# Altium project UZ_D_Voltage.PrjPCB (part 1 of 3)
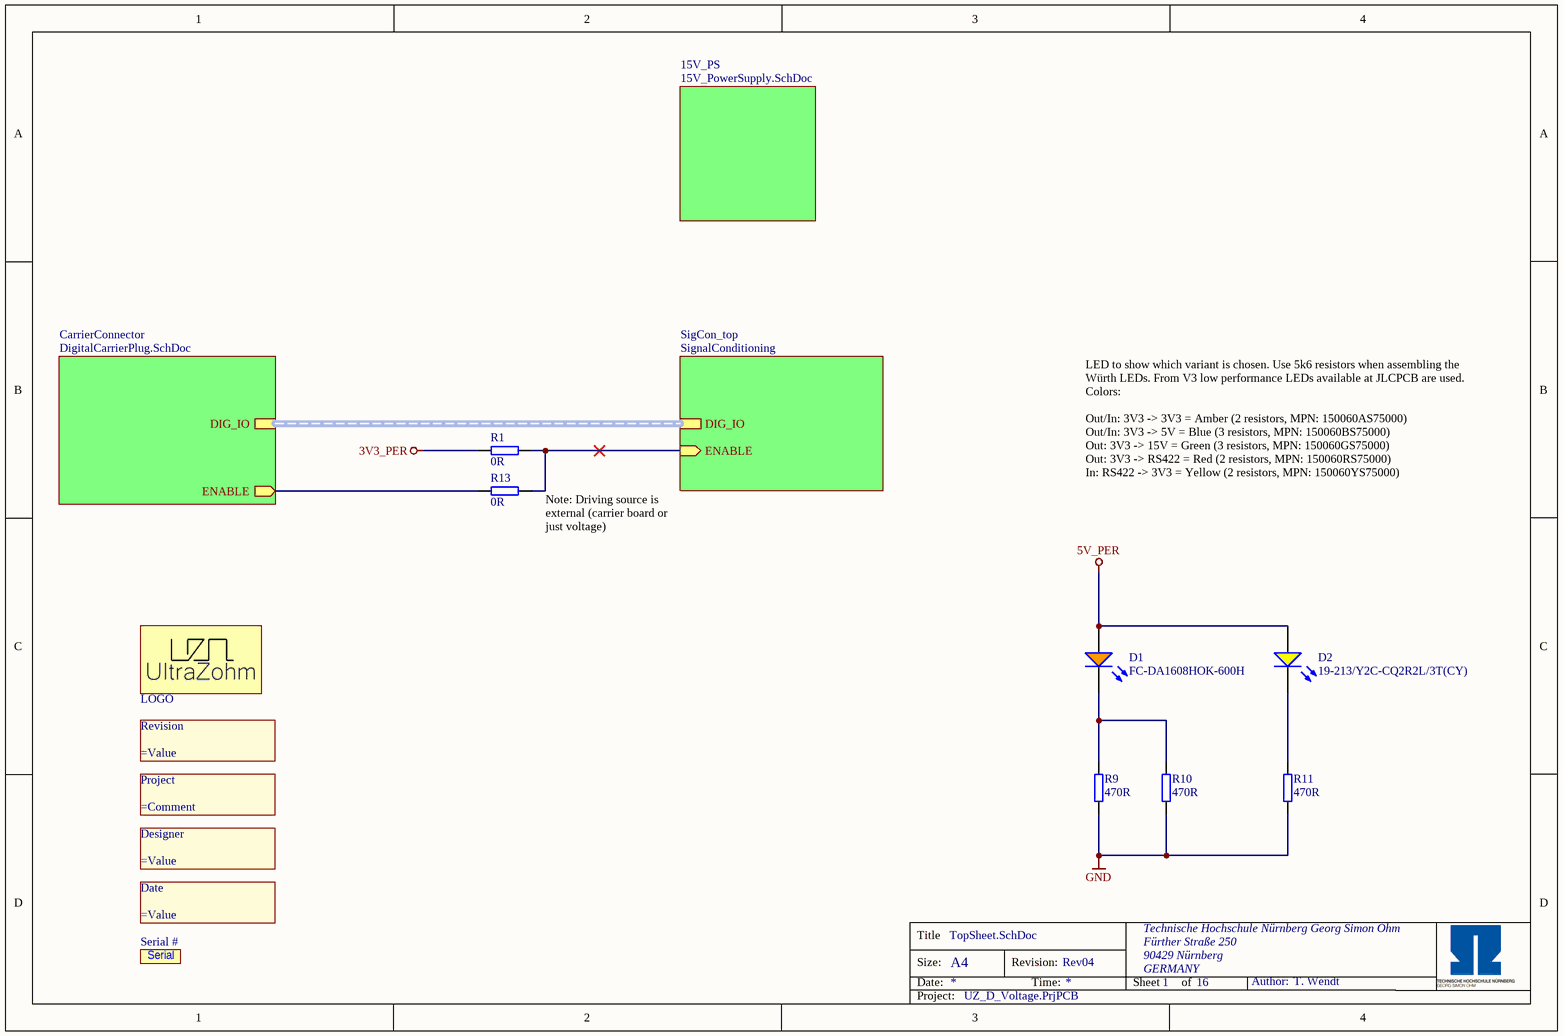
[diagram p0: TopSheet.SchDoc]
Author: T. Wendt; AuthorParam: T. Wendt; Date: 11/2019; FinDate: 08/2021; ProjectNameCustom: UZ_D_Voltage; ProjectRevision: Rev04
17 sheets, 308 parts. Net scope: hierarchical (ports join the sheet entries above them; power ports are global).
Board file: UZ_D_Voltage.PcbDoc
Sheets:
  TopSheet.SchDoc
    SigCon_top = SignalConditioning.SchDoc
      LS5V_top = 3V3_to_5V.SchDoc
        LS5V_B = TI_SN74LVCH16T245.SchDoc
        LS5V_A = TI_SN74LVCH16T245.SchDoc
        JPLS5V = Jumper5VLS.SchDoc
        DMP5VLS = Snubber5VLS.SchDoc
      LS15V_top = 5V_to_15V.SchDoc
        LS15V1 = ONSEMI_MC14504BDR2G.SchDoc
        LS15V2 = ONSEMI_MC14504BDR2G.SchDoc
        LS15V3 = ONSEMI_MC14504BDR2G.SchDoc
        LS15V4 = ONSEMI_MC14504BDR2G.SchDoc
        LS15V5 = ONSEMI_MC14504BDR2G.SchDoc
      RS422_top = SingleToDifferential.SchDoc
        RS422A = TI_DS26C31T.SchDoc
        RS4221 = TI_DS26C31T.SchDoc
        RS4222 = TI_DS26C31T.SchDoc
        RS4223 = TI_DS26C31T.SchDoc
        RS4224 = TI_DS26C31T.SchDoc
        RS4225 = TI_DS26C31T.SchDoc
        RS4226 = TI_DS26C31T.SchDoc
        RS4227 = TI_DS26C31T.SchDoc
      RS422_rec_top = DifferentialToSingle.SchDoc
        RS422_rec_H = TI_DS26C32AT.SchDoc
        RS422_rec1 = TI_DS26C32AT.SchDoc
        RS422_rec2 = TI_DS26C32AT.SchDoc
        RS422_rec3 = TI_DS26C32AT.SchDoc
        RS422_rec4 = TI_DS26C32AT.SchDoc
        RS422_rec5 = TI_DS26C32AT.SchDoc
        RS422_rec6 = TI_DS26C32AT.SchDoc
        RS422_rec7 = TI_DS26C32AT.SchDoc
      Bundle = SignalBundling.SchDoc
        NT15Diff = NetTieSingleAndDiff.SchDoc
        Termination = TermSingleAndDiff.SchDoc
    CarrierConnector = DigitalCarrierPlug.SchDoc
    15V_PS = 15V_PowerSupply.SchDoc

## Sheet TopSheet.SchDoc
size A4; Author: T. Wendt; CompanyName: Technische Hochschule Nürnberg Georg Simon Ohm; Address1: Fürther Straße 250; Address2: 90429 Nürnberg; Address3: GERMANY; DocumentNumber: 1; SheetNumber: 1; SheetTotal: 16; CompanyName2: Institut ELSYS

### Parts
D1  FC-DA1608HOK-600H  [WL-SMCW_0603]
D2  19-213/Y2C-CQ2R2L/3T(CY)  [WL-SMCW_0603]
Date  (no value)  [COMMENT]  (no BOM)
Designer  (no value)  [Designator:comment]  (no BOM)
LOGO  UZ Logo  [UZ_Logo_small]  (value not drawn)  (no BOM)
Project  (no value)  [COMMENT]  (no BOM)
R1  0R  [RES 0603_1608]
R9  470R  [RES 0603_1608]
R10  470R  [RES 0603_1608]
R11  470R  [RES 0603_1608]
R13  0R  [RES 0603_1608]
Revision  (no value)  [Designator:comment]  (no BOM)
Serial  Serial #  [SERIAL]  (no BOM)

### Sub-sheets
15V_PS = 15V_PowerSupply.SchDoc: no entries
CarrierConnector = DigitalCarrierPlug.SchDoc: ENABLE (out), DIG_IO (harness DigCon_DIG_IO)
SigCon_top = SignalConditioning: DIG_IO (harness DigCon_DIG_IO), ENABLE (in)

### Nets
3V3_PER: R1.1
5V_PER: D1.2(A) D2.2(A)
GND: R9.1 R10.1 R11.1
ENABLE: R1.2 R13.2 ; sheet SigCon_top/ENABLE
PS_DIG_GPIO_01: R13.1 ; sheet CarrierConnector/ENABLE
NetD1_1: D1.1(K) R9.2 R10.2
NetD2_1: D2.1(K) R11.2

### Buses and harness runs
harness sheet CarrierConnector/DIG_IO = sheet SigCon_top/DIG_IO

### Notes on the sheet
- LED to show which variant is chosen. Use 5k6 resistors when assembling the Würth LEDs. From V3 low performance LEDs available at JLCPCB are used.
  Colors:
  Out/In: 3V3 -> 3V3 = Amber (2 resistors, MPN: 150060AS75000)
  Out/In: 3V3 -> 5V = Blue (3 resistors, MPN: 150060BS75000)
  Out: 3V3 -> 15V = Green (3 resistors, MPN: 150060GS75000)
  Out: 3V3 -> RS422 = Red (2 resistors, MPN: 150060RS75000)
  In: RS422 -> 3V3 = Yellow (2 resistors, MPN: 150060YS75000)
- (near R13) Note: Driving source is external (carrier board or just voltage)
- Title
- Size:
- Date:
- A4
- Revision:
- Time:
- Sheet
- of
- Author:
- Project:

### Library data of the parts
D1 = FC-DA1608HOK-600H: LED ORANGE 600~610NM 80~220MCD@20MA TOP VIEW 0603 ROHS; Manufacturer: Foshan NationStar Optoelectronics; Type: Standard; Created from: T. Wendt; Color: amber; Forward Current I_f: 20 mA; Forward Voltage U_f: 2 V; Wavelength: 604 nm; Light Intensity: 150 mcd; Nominal Power: 40 mW; Manufacturer Part Number: FC-DA1608HOK-600H; PartID: 10; Created On: 03.03.2021 09:59:51; ComponentLink1Description: Datasheet; ComponentLink1URL: https://datasheet.lcsc.com/szlcsc/Foshan-NationStar-Optoelectronics-FC-DA1608HOK-600H_C84269.pdf; Component Type: LED Diode; Device Package: 0603; Last Updated: 04.03.2021 09:02:50; Mounting Type: SMD; Operating Temperature: -40 - 85 °C; Supplier 1: LCSC; Supplier Part Number 1: C84269; Live Cycle Status: 1; Stock number: not stored; LCSC Part Number: C84269
D2 = 19-213/Y2C-CQ2R2L/3T(CY): LED YELLOW 585.5~591.5NM 90~180MCD@20MA TOP VIEW 0603 ROHS; Manufacturer: Everlight Elec; Type: Standard; Created from: T. Wendt; Forward Current I_f: 20 mA; Forward Voltage U_f: 2 V; Wavelength: 590 nm; Light Intensity: 180 mcd; Nominal Power: 40 mW; Manufacturer Part Number: 19-213/Y2C-CQ2R2L/3T(CY); PartID: 9; Created On: 03.03.2021 10:06:23; ComponentLink1Description: Datasheet; ComponentLink1URL: https://datasheet.lcsc.com/szlcsc/Everlight-Elec-19-213-Y2C-CQ2R2L-3T-CY_C72038.pdf; Component Type: LED Diode; Device Package: 0603; Last Updated: 04.03.2021 09:02:49; Mounting Type: SMD; Operating Temperature: -40 - 85 °C; Supplier 1: LCSC; Supplier Part Number 1: C72038; Live Cycle Status: 1; Stock number: not stored; Color: yellow; LCSC Part Number: C72038
Date = 5: Create a project parameter named "FinDate" this is the value of this component. It is printed on the PCB. Once the parameter is updated (e.g. new revision) it gets updated on the PCB as well; Manufacturer: PCB Manufacturer; Manufacturer Part Number: Project End Date; Value: 08/2021; Created from: T. Wendt; PartID: 5; Created On: 01.03.2021 09:01:41; Component Type: Date of Project Finalization; Last Updated: 01.03.2021 09:01:41; Type: Standard (No BOM); Live Cycle Status: 1
Designer = 4: Create a project parameter named "Author" this is the value of this component. It is printed on the PCB. Once the parameter is updated (e.g. new revision) it gets updated on the PCB as well; Manufacturer: PCB Manufacturer; Manufacturer Part Number: Project Author; Value: T. Wendt; PartID: 4; Created On: 01.03.2021 08:53:41; Component Type: Project Author; Last Updated: 01.03.2021 09:20:27; Type: Standard (No BOM); Created from: T. Wendt; Live Cycle Status: 1
LOGO = UZ Logo: Official Project Logo of the UltraZohm; Created from: T. Wendt; PartID: 1; Created On: 19.02.2021 16:55:56; ComponentLink1Description: Homepage; ComponentLink1URL: https://ultrazohm.com; Component Type: Logo; Last Updated: 19.02.2021 17:22:43; Type: Graphical; Live Cycle Status: 1
Project = 2: Create a project parameter named "ProjectNameCustom" this is the value of this component and it is printed on the PCB.; Manufacturer: PCB Manufacturer; Value: UZ_D_Voltage; Created from: T. Wendt; PartID: 2; Created On: 01.03.2021 08:43:57; Component Type: Project Name; Last Updated: 01.03.2021 09:07:27; Manufacturer Part Number: Project Name; Type: Standard (No BOM); Live Cycle Status: 1
R1 R13 = RC0603JR-070RL: SMD resistor E24 series; Manufacturer: YAGEO; Tolerance: 5%; Created from: MGremer; Manufacturer Part Number: RC0603JR-070RL; PartID: 1; Created On: 14.12.2020 16:17:14; ComponentLink1Description: Datasheet; ComponentLink1URL: https://www.mouser.de/datasheet/2/447/PYu-RC_Group_51_RoHS_L_10-1664068.pdf; Component Type: SMD resistor; Device Package: 0603; Last Updated: 04.03.2021 09:09:42; Mounting Type: SMD; Supplier 1: Mouser; Supplier Part Number 1: 603-RC0603JR-070RL; Type: Resistor; Value: 0R; Live Cycle Status: 1; Stock number: Labor SMD Container; LCSC Part Number: C21189; Supplier 2: LCSC; Supplier Part Number 2: C21189
R9-R11 = RK73B1JTTD471J: SMD resistor E24 series; Manufacturer: KOA Speer; Tolerance: 5%; Created from: MGremer; Manufacturer Part Number: RK73B1JTTD471J; PartID: 66; Created On: 14.12.2020 16:17:14; ComponentLink1Description: Datasheet; ComponentLink1URL: https://www.mouser.de/datasheet/2/219/RK73B-1825463.pdf; Component Type: SMD resistor; Device Package: 0603; Last Updated: 04.03.2021 10:03:02; Mounting Type: SMD; Supplier 1: Mouser; Supplier Part Number 1: 660-RK73B1JTTD471J; Supplier 2: LCSC; Supplier Part Number 2: C23179; Type: Resistor; Value: 470R; Live Cycle Status: 1; Stock number: Labor SMD Container; LCSC Part Number: C23179
Revision = 3: Create a project parameter named "ProjectRevision" this is the value of this component. It is printed on the PCB. Once the parameter is updated (e.g. new revision) it gets updated on the PCB as well; Manufacturer: PCB Manufacturer; Value: Rev04; Created from: T. Wendt; PartID: 3; Created On: 01.03.2021 08:50:34; Component Type: Project Revision; Last Updated: 01.03.2021 09:28:36; Manufacturer Part Number: Project Revision; Type: Standard (No BOM); Live Cycle Status: 1
Serial = 6: Field to put in a serial number; Manufacturer: PCB Manufacturer; Created from: T. Wendt; PartID: 6; Created On: 02.03.2021 14:31:24; Component Type: Serial Number; Last Updated: 02.03.2021 14:31:24; Manufacturer Part Number: Serial Number; Type: Standard (No BOM); Live Cycle Status: 1

## Sheet SignalConditioning.SchDoc
size A4; Author: T. Wendt; CompanyName: Technische Hochschule Nürnberg Georg Simon Ohm; Address1: Fürther Straße 250; Address2: 90429 Nürnberg; Address3: GERMANY; DocumentNumber: 2; SheetNumber: 2; SheetTotal: 16; CompanyName2: Institut ELSYS
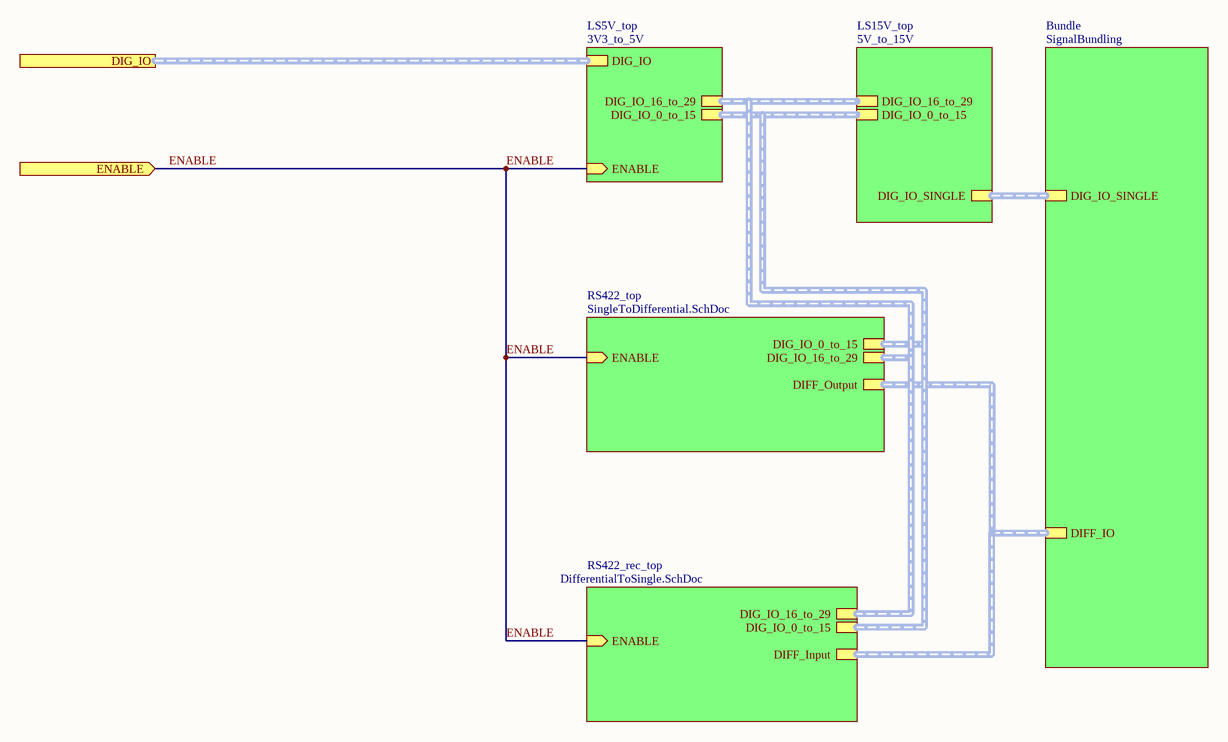
[diagram p1: SignalConditioning.SchDoc]

### Sub-sheets
Bundle = SignalBundling: DIFF_IO (harness DIFF_IO), DIG_IO_SINGLE (harness DIG_IO_SINGLE)
LS5V_top = 3V3_to_5V: DIG_IO (harness DigCon_DIG_IO), DIG_IO_16_to_29 (harness SN74LVCH16T245_B), DIG_IO_0_to_15 (harness SN74LVCH16T245_B), ENABLE (in)
LS15V_top = 5V_to_15V: DIG_IO_16_to_29 (harness SN74LVCH16T245_B), DIG_IO_0_to_15 (harness SN74LVCH16T245_B), DIG_IO_SINGLE (harness DIG_IO_SINGLE)
RS422_rec_top = DifferentialToSingle.SchDoc: ENABLE (in), DIFF_Input (harness DIFF_IO), DIG_IO_16_to_29 (harness SN74LVCH16T245_B), DIG_IO_0_to_15 (harness SN74LVCH16T245_B)
RS422_top = SingleToDifferential.SchDoc: ENABLE (in), DIG_IO_16_to_29 (harness SN74LVCH16T245_B), DIG_IO_0_to_15 (harness SN74LVCH16T245_B), DIFF_Output (harness DIFF_IO)

### Ports
DIG_IO (harness DigCon_DIG_IO), ENABLE (in)

### Nets
ENABLE: port ENABLE, sheet LS5V_top/ENABLE, sheet RS422_top/ENABLE, sheet RS422_rec_top/ENABLE

### Buses and harness runs
harness port DIG_IO = sheet LS5V_top/DIG_IO
harness sheet Bundle/DIFF_IO = sheet RS422_rec_top/DIFF_Input = sheet RS422_top/DIFF_Output
harness sheet Bundle/DIG_IO_SINGLE = sheet LS15V_top/DIG_IO_SINGLE
harness sheet LS5V_top/DIG_IO_0_to_15 = sheet LS15V_top/DIG_IO_0_to_15 = sheet RS422_rec_top/DIG_IO_0_to_15 = sheet RS422_top/DIG_IO_0_to_15
harness sheet LS5V_top/DIG_IO_16_to_29 = sheet LS15V_top/DIG_IO_16_to_29 = sheet RS422_rec_top/DIG_IO_16_to_29 = sheet RS422_top/DIG_IO_16_to_29

### Notes on the sheet
- Title
- Size:
- Date:
- A4
- Revision:
- Time:
- Sheet
- of
- Author:
- Project:

## Sheet 3V3_to_5V.SchDoc
size A4; Author: T. Wendt; CompanyName: Technische Hochschule Nürnberg Georg Simon Ohm; Address1: Fürther Straße 250; Address2: 90429 Nürnberg; Address3: GERMANY; DocumentNumber: 3; SheetNumber: 3; SheetTotal: 16; CompanyName2: Institut ELSYS
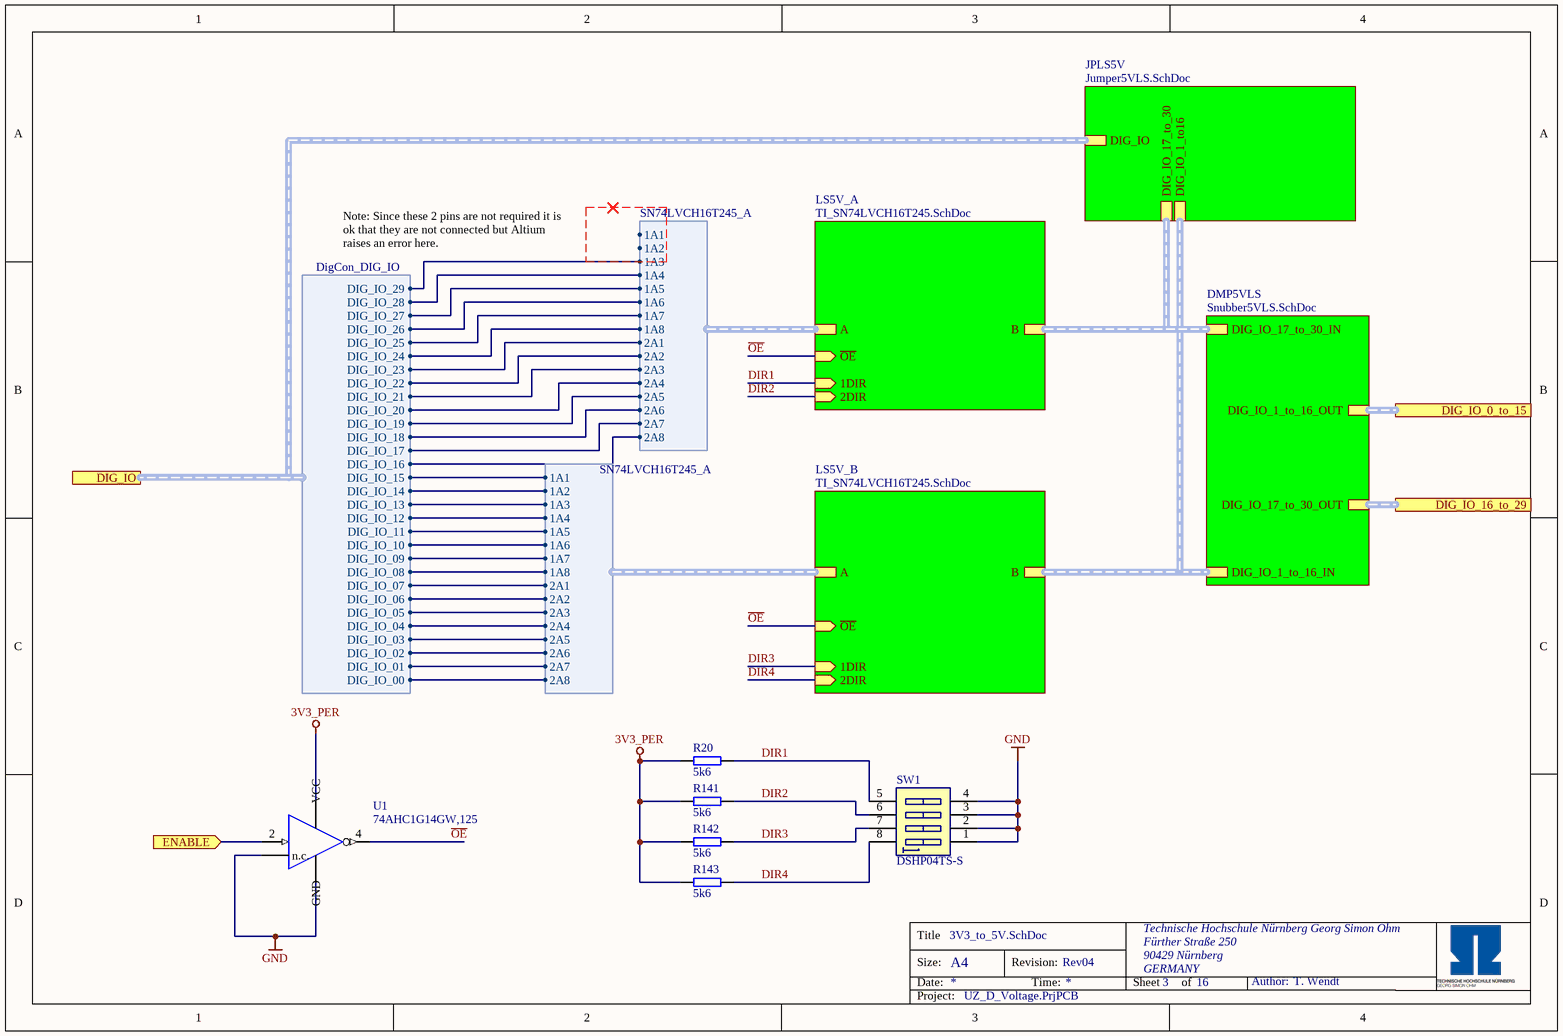
[diagram p2: 3V3_to_5V.SchDoc]

### Parts
R20  5k6  [RES 0603_1608]
R141  5k6  [RES 0603_1608]
R142  5k6  [RES 0603_1608]
R143  5k6  [RES 0603_1608]
SW1  DSHP04TS-S  [416131160804]
U1  74AHC1G14GW,125  [SOT353-1_N]

### Sub-sheets
DMP5VLS = Snubber5VLS.SchDoc: DIG_IO_1_to_16_IN (harness SN74LVCH16T245_B), DIG_IO_1_to_16_OUT (harness SN74LVCH16T245_B), DIG_IO_17_to_30_IN (harness SN74LVCH16T245_B), DIG_IO_17_to_30_OUT (harness SN74LVCH16T245_B)
JPLS5V = Jumper5VLS.SchDoc: DIG_IO (harness DigCon_DIG_IO), DIG_IO_17_to_30 (harness SN74LVCH16T245_B), DIG_IO_1_to16 (harness SN74LVCH16T245_B)
LS5V_A = TI_SN74LVCH16T245.SchDoc: A (harness SN74LVCH16T245_A), B (harness SN74LVCH16T245_B), 2DIR (in), ~{OE} (in), 1DIR (in)
LS5V_B = TI_SN74LVCH16T245.SchDoc: A (harness SN74LVCH16T245_A), B (harness SN74LVCH16T245_B), ~{OE} (in), 2DIR (in), 1DIR (in)

### Ports
DIG_IO (harness DigCon_DIG_IO), DIG_IO_0_to_15 (harness SN74LVCH16T245_B), DIG_IO_16_to_29 (harness SN74LVCH16T245_B), ENABLE (in)

### Harnesses
SN74LVCH16T245_A: 1A1, 1A2, 1A3, 1A4, 1A5, 1A6, 1A7, 1A8, 2A1, 2A2, 2A3, 2A4, 2A5, 2A6, 2A7, 2A8
DigCon_DIG_IO: DIG_IO_00, DIG_IO_01, DIG_IO_02, DIG_IO_03, DIG_IO_04, DIG_IO_05, DIG_IO_06, DIG_IO_07, DIG_IO_08, DIG_IO_09, DIG_IO_10, DIG_IO_11, DIG_IO_12, DIG_IO_13, DIG_IO_14, DIG_IO_15, DIG_IO_16, DIG_IO_17, DIG_IO_18, DIG_IO_19, DIG_IO_20, DIG_IO_21, DIG_IO_22, DIG_IO_23, DIG_IO_24, DIG_IO_25, DIG_IO_26, DIG_IO_27, DIG_IO_28, DIG_IO_29

### Nets
3V3_PER: R20.2 R141.2 R142.2 R143.2 U1.5(VCC)
GND: SW1.1 SW1.2 SW1.3 SW1.4 U1.1(n.c.) U1.3(GND)
DIG_IO_00: sheet LS5V_B/A.2A8, port DIG_IO.DIG_IO_00
DIG_IO_01: sheet LS5V_B/A.2A7, port DIG_IO.DIG_IO_01
DIG_IO_02: sheet LS5V_B/A.2A6, port DIG_IO.DIG_IO_02
DIG_IO_03: sheet LS5V_B/A.2A5, port DIG_IO.DIG_IO_03
DIG_IO_04: sheet LS5V_B/A.2A4, port DIG_IO.DIG_IO_04
DIG_IO_05: sheet LS5V_B/A.2A3, port DIG_IO.DIG_IO_05
DIG_IO_06: sheet LS5V_B/A.2A2, port DIG_IO.DIG_IO_06
DIG_IO_07: sheet LS5V_B/A.2A1, port DIG_IO.DIG_IO_07
DIG_IO_08: sheet LS5V_B/A.1A8, port DIG_IO.DIG_IO_08
DIG_IO_09: sheet LS5V_B/A.1A7, port DIG_IO.DIG_IO_09
DIG_IO_10: sheet LS5V_B/A.1A6, port DIG_IO.DIG_IO_10
DIG_IO_11: sheet LS5V_B/A.1A5, port DIG_IO.DIG_IO_11
DIG_IO_12: sheet LS5V_B/A.1A4, port DIG_IO.DIG_IO_12
DIG_IO_13: sheet LS5V_B/A.1A3, port DIG_IO.DIG_IO_13
DIG_IO_14: sheet LS5V_B/A.1A2, port DIG_IO.DIG_IO_14
DIG_IO_15: sheet LS5V_B/A.1A1, port DIG_IO.DIG_IO_15
DIG_IO_16: port DIG_IO.DIG_IO_16, sheet LS5V_A/A.2A8
DIG_IO_17: port DIG_IO.DIG_IO_17, sheet LS5V_A/A.2A7
DIG_IO_18: port DIG_IO.DIG_IO_18, sheet LS5V_A/A.2A6
DIG_IO_19: port DIG_IO.DIG_IO_19, sheet LS5V_A/A.2A5
DIG_IO_20: port DIG_IO.DIG_IO_20, sheet LS5V_A/A.2A4
DIG_IO_21: port DIG_IO.DIG_IO_21, sheet LS5V_A/A.2A3
DIG_IO_22: port DIG_IO.DIG_IO_22, sheet LS5V_A/A.2A2
DIG_IO_23: port DIG_IO.DIG_IO_23, sheet LS5V_A/A.2A1
DIG_IO_24: port DIG_IO.DIG_IO_24, sheet LS5V_A/A.1A8
DIG_IO_25: port DIG_IO.DIG_IO_25, sheet LS5V_A/A.1A7
DIG_IO_26: port DIG_IO.DIG_IO_26, sheet LS5V_A/A.1A6
DIG_IO_27: port DIG_IO.DIG_IO_27, sheet LS5V_A/A.1A5
DIG_IO_28: port DIG_IO.DIG_IO_28, sheet LS5V_A/A.1A4
DIG_IO_29: port DIG_IO.DIG_IO_29, sheet LS5V_A/A.1A3
DIR1: R20.1 SW1.5 ; sheet LS5V_A/1DIR
DIR2: R141.1 SW1.6 ; sheet LS5V_A/2DIR
DIR3: R142.1 SW1.7 ; sheet LS5V_B/1DIR
DIR4: R143.1 SW1.8 ; sheet LS5V_B/2DIR
ENABLE: U1.2(A) ; port ENABLE
~{OE}: U1.4(~{Y}) ; sheet LS5V_B/~{OE}, sheet LS5V_A/~{OE}

### Buses and harness runs
harness port DIG_IO = sheet JPLS5V/DIG_IO
harness port DIG_IO_0_to_15 = sheet DMP5VLS/DIG_IO_1_to_16_OUT
harness port DIG_IO_16_to_29 = sheet DMP5VLS/DIG_IO_17_to_30_OUT
harness sheet DMP5VLS/DIG_IO_1_to_16_IN = sheet JPLS5V/DIG_IO_1_to16 = sheet LS5V_B/B
harness sheet DMP5VLS/DIG_IO_17_to_30_IN = sheet JPLS5V/DIG_IO_17_to_30 = sheet LS5V_A/B

### Notes on the sheet
- Note: Since these 2 pins are not required it is ok that they are not connected but Altium raises an error here.
- Title
- Size:
- Date:
- A4
- Revision:
- Time:
- Sheet
- of
- Author:
- Project:

### Library data of the parts
R20 R141-R143 = RK73B1JTTDD562J: SMD resistor E24 series; Manufacturer: KOA Speer; Tolerance: 5%; Created from: MGremer; Manufacturer Part Number: RK73B1JTTDD562J; PartID: 92; Created On: 14.12.2020 16:17:14; ComponentLink1Description: Datasheet; ComponentLink1URL: https://www.mouser.de/datasheet/2/219/RK73B-1825463.pdf; Component Type: SMD resistor; Device Package: 0603; Last Updated: 04.03.2021 09:09:42; Mounting Type: SMD; Supplier 1: Mouser; Supplier Part Number 1: 660-RK73B1JTTDD562J; Type: Resistor; Value: 5k6; Live Cycle Status: 1; Stock number: Labor SMD Container; LCSC Part Number: C23189; Supplier 2: LCSC; Supplier Part Number 2: C23189
SW1 = DSHP04TS-S: 04p, 1.27mm Pitch, Horizontal, HP Type, SMT, flat Actuator, black, with Tape, T&R; Manufacturer: XKB Connectivity; Created from: T. Wendt; Manufacturer Part Number: DSHP04TS-S; PartID: 6; Created On: 02.03.2021 14:59:37; ComponentLink1Description: Datasheet; ComponentLink1URL: https://datasheet.lcsc.com/szlcsc/1912111437_XKB-Connectivity-DSHP04TS-S_C319050.pdf; Component Type: DIP-Switch; Device Package: DIP; Last Updated: 02.03.2021 14:59:37; Minimum Order: 1; Mounting Type: SMD; Supplier 1: LCSC; Supplier Part Number 1: C319050; Type: DIP-Switch; Live Cycle Status: 1; LCSC Part Number: C319050; Stock number: not stored
U1 = 74AHC1G14GW,125: Inverting Schmitt trigger; Manufacturer: Nexperia; Value: 5.5 V; Created from: MGremer; Manufacturer Part Number: 74AHC1G14GW,125; PartID: 1; Created On: 19.01.2021 10:03:39; ComponentLink1Description: Datasheet; ComponentLink1URL: https://www.mouser.de/datasheet/2/916/74AHC_AHCT1G14-1319577.pdf; Component Type: Inverting Schmitt trigger; Device Package: TSSOP-5; Last Updated: 04.03.2021 09:06:25; Mounting Type: SMD; Operating Temperature: -40 - 125 °C; Series: 74AHC; Supplier 1: Mouser; Supplier Part Number 1: 771-74AHC1G14GW-G; Supplier 2: LCSC; Supplier Part Number 2: C282410; Type: Schmitt trigger; Live Cycle Status: 1; Stock number: not stored; LCSC Part Number: C282410

## Sheet TI_SN74LVCH16T245.SchDoc
size A4; Author: T. Wendt; CompanyName: Technische Hochschule Nürnberg Georg Simon Ohm; Address1: Fürther Straße 250; Address2: 90429 Nürnberg; Address3: GERMANY; SheetNumber: 17; SheetTotal: 17; CompanyName2: Institut ELSYS
Used 2 times, as channels SigCon_top/LS5V_top/LS5V_B, SigCon_top/LS5V_top/LS5V_A. Parts and nets are listed once, with the designators drawn on the sheet.
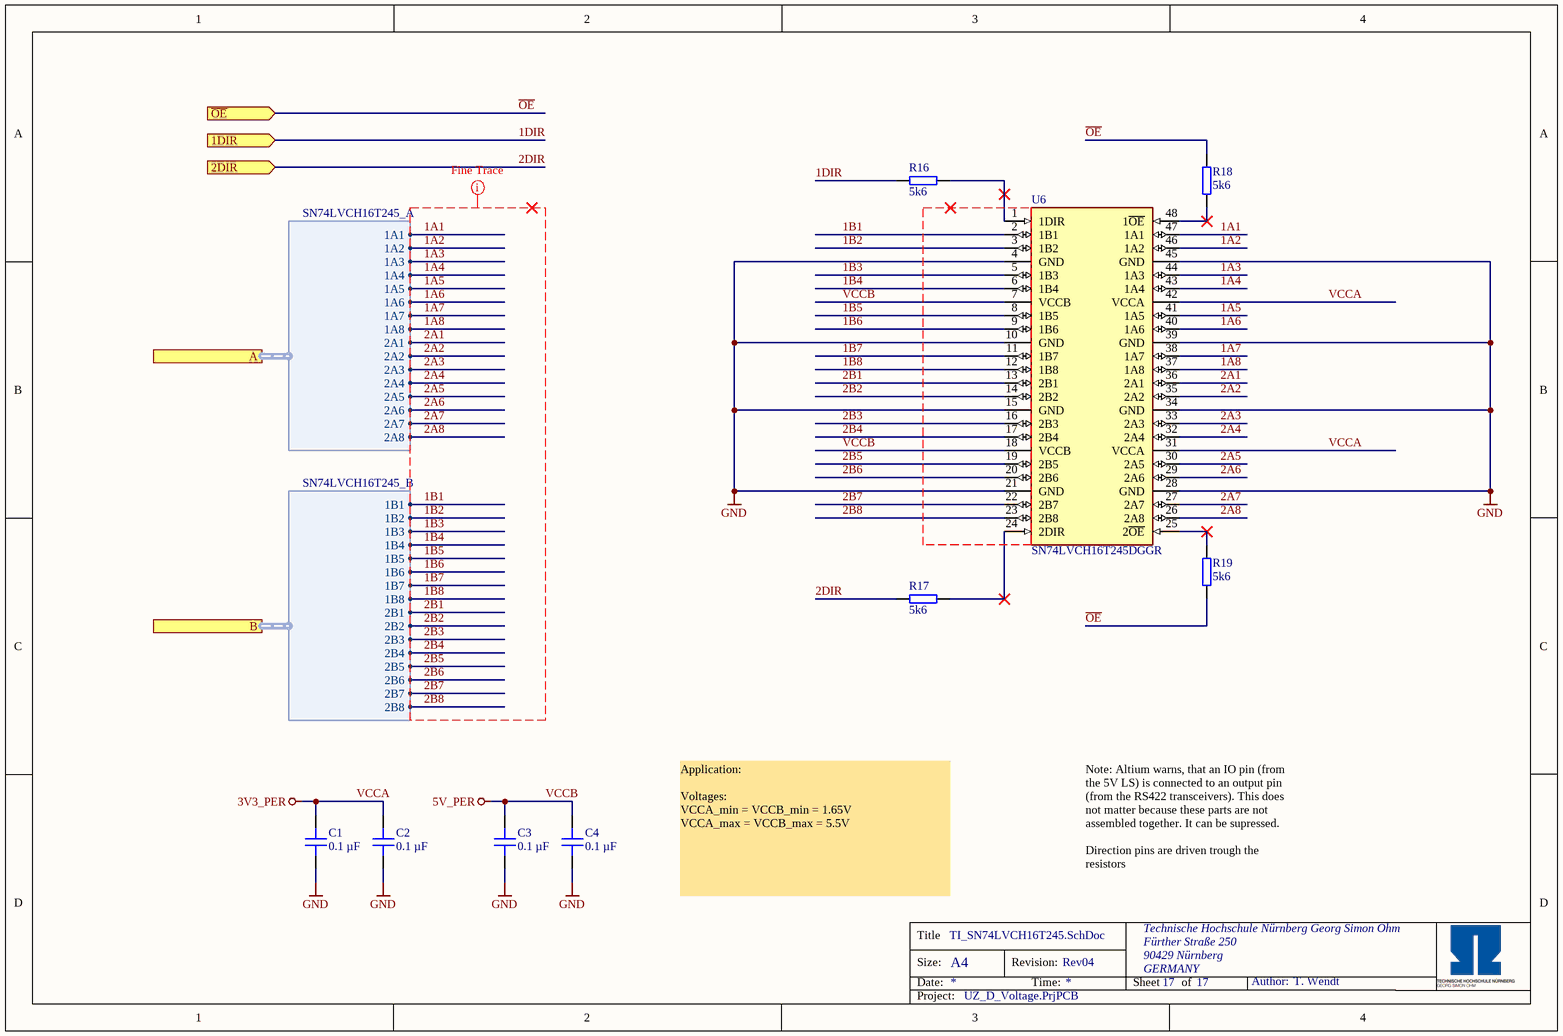
[diagram p3: TI_SN74LVCH16T245.SchDoc]

### Parts
C1  0.1 µF  [C_0603]
C2  0.1 µF  [C_0603]
C3  0.1 µF  [C_0603]
C4  0.1 µF  [C_0603]
R16  5k6  [RES 0603_1608]
R17  5k6  [RES 0603_1608]
R18  5k6  [RES 0603_1608]
R19  5k6  [RES 0603_1608]
U6  SN74LVCH16T245DGGR  [TI_DGG-R-PDSO-G48N]

### Ports
1DIR (in), 2DIR (in), A (harness SN74LVCH16T245_A), B (harness SN74LVCH16T245_B), ~{OE} (in)

### Harnesses
SN74LVCH16T245_A: 1A1, 1A2, 1A3, 1A4, 1A5, 1A6, 1A7, 1A8, 2A1, 2A2, 2A3, 2A4, 2A5, 2A6, 2A7, 2A8
SN74LVCH16T245_B: 1B1, 1B2, 1B3, 1B4, 1B5, 1B6, 1B7, 1B8, 2B1, 2B2, 2B3, 2B4, 2B5, 2B6, 2B7, 2B8

### Nets
GND: C1.1 C2.1 C3.1 C4.1 U6.4(GND) U6.10(GND) U6.15(GND) U6.21(GND) U6.28(GND) U6.34(GND) U6.39(GND) U6.45(GND)
VCCA: C1.2 C2.2 U6.31(VCCA) U6.42(VCCA)  [also labelled 3V3_PER]
VCCB: C3.2 C4.2 U6.7(VCCB) U6.18(VCCB)  [also labelled 5V_PER]
1A1: U6.47(1A1) ; port A.1A1
1A2: U6.46(1A2) ; port A.1A2
1A3: U6.44(1A3) ; port A.1A3
1A4: U6.43(1A4) ; port A.1A4
1A5: U6.41(1A5) ; port A.1A5
1A6: U6.40(1A6) ; port A.1A6
1A7: U6.38(1A7) ; port A.1A7
1A8: U6.37(1A8) ; port A.1A8
1B1: U6.2(1B1) ; port B.1B1
1B2: U6.3(1B2) ; port B.1B2
1B3: U6.5(1B3) ; port B.1B3
1B4: U6.6(1B4) ; port B.1B4
1B5: U6.8(1B5) ; port B.1B5
1B6: U6.9(1B6) ; port B.1B6
1B7: U6.11(1B7) ; port B.1B7
1B8: U6.12(1B8) ; port B.1B8
1DIR: R16.2 ; port 1DIR
2A1: U6.36(2A1) ; port A.2A1
2A2: U6.35(2A2) ; port A.2A2
2A3: U6.33(2A3) ; port A.2A3
2A4: U6.32(2A4) ; port A.2A4
2A5: U6.30(2A5) ; port A.2A5
2A6: U6.29(2A6) ; port A.2A6
2A7: U6.27(2A7) ; port A.2A7
2A8: U6.26(2A8) ; port A.2A8
2B1: U6.13(2B1) ; port B.2B1
2B2: U6.14(2B2) ; port B.2B2
2B3: U6.16(2B3) ; port B.2B3
2B4: U6.17(2B4) ; port B.2B4
2B5: U6.19(2B5) ; port B.2B5
2B6: U6.20(2B6) ; port B.2B6
2B7: U6.22(2B7) ; port B.2B7
2B8: U6.23(2B8) ; port B.2B8
2DIR: R17.1 ; port 2DIR
~{OE}: R18.2 R19.1 ; port ~{OE}
NetR16_1: R16.1 U6.1(1DIR)
NetR17_2: R17.2 U6.24(2DIR)
NetR18_1: R18.1 U6.48(1~{OE})
NetR19_2: R19.2 U6.25(2~{OE})

### Channels
SigCon_top/LS5V_top/LS5V_B: designators end in A; ports 1DIR=DIR3 2DIR=DIR4 ~{OE}=~{OE}
SigCon_top/LS5V_top/LS5V_A: designators end in B; ports 1DIR=DIR1 2DIR=DIR2 ~{OE}=~{OE}

### Layout directives
net class Fine Trace: 1A1, 1A2, 1A3, 1A4, 1A5, 1A6, 1A7, 1A8, 1B1, 1B2, 1B3, 1B4, 1B5, 1B6, 1B7, 1B8, 2A1, 2A2, 2A3, 2A4, 2A5, 2A6, 2A7, 2A8, 2B1, 2B2, 2B3, 2B4, 2B5, 2B6, 2B7, 2B8

### Notes on the sheet
- Application:
  Voltages:
  VCCA_min = VCCB_min = 1.65V
  VCCA_max = VCCB_max = 5.5V
- Note: Altium warns, that an IO pin (from the 5V LS) is connected to an output pin (from the RS422 transceivers). This does not matter because these parts are not assembled together. It can be supressed.
  Direction pins are driven trough the resistors
- Title
- Size:
- Date:
- A4
- Revision:
- Time:
- Sheet
- of
- Author:
- Project:

### Library data of the parts
C1-C4 = C0603X104K5RAC7411: Capacitor 0603, 50 VDC, 0.1 µF, X7R; Manufacturer: KEMET; Tolerance: 10 %; Voltage Rating: 50 VDC; Created from: MGremer; Manufacturer Part Number: C0603X104K5RAC7411; PartID: 3; Created On: 20.12.2020 13:54:13; ComponentLink1Description: Datasheet; ComponentLink1URL: https://www.mouser.de/datasheet/2/212/1/KEM_C1013_X7R_FT_CAP_SMD-1103280.pdf; Component Type: Capacitor 0603; Device Package: 0603; Last Updated: 04.03.2021 09:24:28; Mounting Type: SMD; Operating Temperature: -55 - 125°C; Series: SMD Comm X7R Flex; Supplier 1: Mouser; Supplier Part Number 1: 80-C0603X104K5R7411; Type: Capacitor; Value: 0.1 µF; Live Cycle Status: 1; Stock number: Labor SMD Container; LCSC Part Number: C14663; Supplier 2: LCSC; Supplier Part Number 2: C14663
R16-R19 = RK73B1JTTDD562J: as R20 on sheet 3V3_to_5V; Manufacturer Part Number: RK73B1JTTDD562J; PartID: 92; Created On: 14.12.2020 16:17:14; ComponentLink1Description: Datasheet; ComponentLink1URL: https://www.mouser.de/datasheet/2/219/RK73B-1825463.pdf; Component Type: SMD resistor; Device Package: 0603; Last Updated: 04.03.2021 09:09:42; Mounting Type: SMD; Supplier 1: Mouser; Supplier Part Number 1: 660-RK73B1JTTDD562J; Type: Resistor; Value: 5k6; Live Cycle Status: 1; Stock number: Labor SMD Container; LCSC Part Number: C23189; Supplier 2: LCSC; Supplier Part Number 2: C23189
U6 = SN74LVCH16T245DGGR: 16-Bit Dual supply Bus Transceiver with configurable Level Shifter and Tri State Output; Manufacturer: Texas Instruments; Value: 1.65 - 5.5 V; Created from: T. Wendt; Manufacturer Part Number: SN74LVCH16T245DGGR; PartID: 4; Created On: 01.03.2021 11:28:41; ComponentLink1Description: Datasheet; ComponentLink1URL: https://www.ti.com/lit/ds/symlink/sn74lvch16t245.pdf?HQS=dis-mous-null-mousermode-dsf-pf-null-wwe&ts=1610963085859&ref_url=https%253A%252F%252Fwww.mouser.it%252F; Component Type: Level Shifter; Device Package: TSSOP-48; Last Updated: 04.03.2021 09:07:38; Mounting Type: SMD; Operating Temperature: -40 - 85 °C; Supplier 1: Mouser; Supplier Part Number 1: 595-SN74LVCH16T245GR; Type: Standard; Live Cycle Status: 1; Stock number: not stored; LCSC Part Number: C352975; Supplier 2: LCSC; Supplier Part Number 2: C352975

## Sheet Jumper5VLS.SchDoc
size A4; Author: T. Wendt; CompanyName: Technische Hochschule Nürnberg Georg Simon Ohm; Address1: Fürther Straße 250; Address2: 90429 Nürnberg; Address3: GERMANY; DocumentNumber: 12; SheetNumber: 12; SheetTotal: 16; CompanyName2: Institut ELSYS
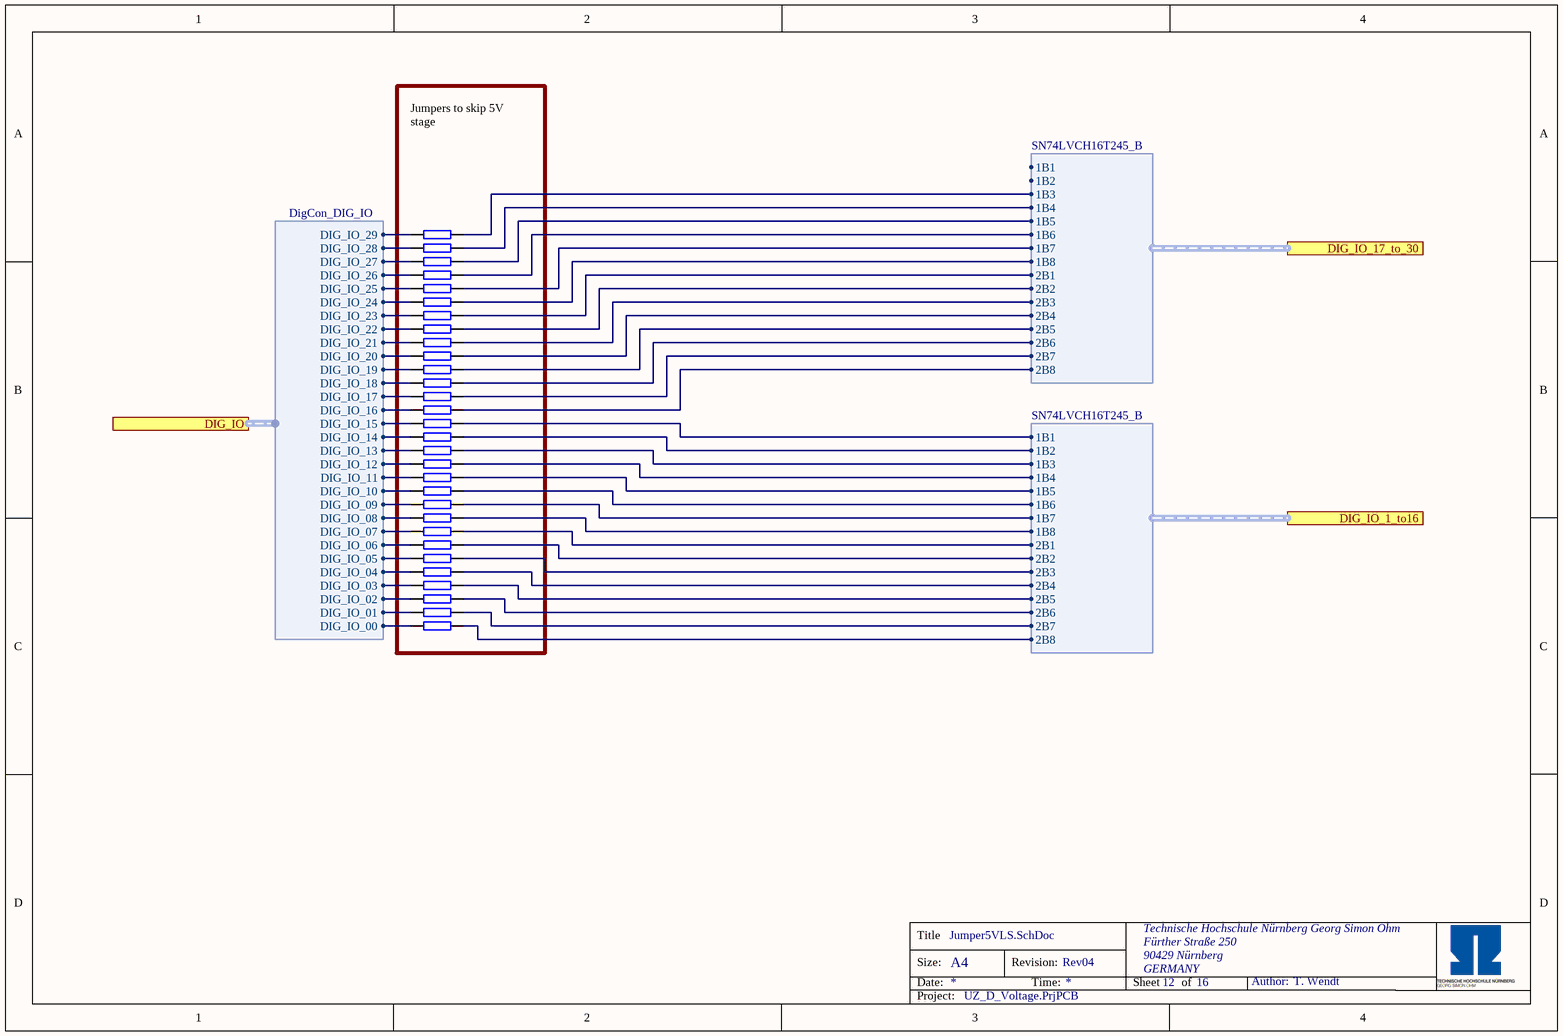
[diagram p4: Jumper5VLS.SchDoc]

### Parts
R51  0R  [RES 0603_1608]  (value not drawn)
R52  0R  [RES 0603_1608]  (value not drawn)
R53  0R  [RES 0603_1608]  (value not drawn)
R54  0R  [RES 0603_1608]  (value not drawn)
R55  0R  [RES 0603_1608]  (value not drawn)
R56  0R  [RES 0603_1608]  (value not drawn)
R57  0R  [RES 0603_1608]  (value not drawn)
R58  0R  [RES 0603_1608]  (value not drawn)
R59  0R  [RES 0603_1608]  (value not drawn)
R60  0R  [RES 0603_1608]  (value not drawn)
R61  0R  [RES 0603_1608]  (value not drawn)
R62  0R  [RES 0603_1608]  (value not drawn)
R63  0R  [RES 0603_1608]  (value not drawn)
R64  0R  [RES 0603_1608]  (value not drawn)
R65  0R  [RES 0603_1608]  (value not drawn)
R66  0R  [RES 0603_1608]  (value not drawn)
R67  0R  [RES 0603_1608]  (value not drawn)
R68  0R  [RES 0603_1608]  (value not drawn)
R69  0R  [RES 0603_1608]  (value not drawn)
R70  0R  [RES 0603_1608]  (value not drawn)
R71  0R  [RES 0603_1608]  (value not drawn)
R72  0R  [RES 0603_1608]  (value not drawn)
R73  0R  [RES 0603_1608]  (value not drawn)
R74  0R  [RES 0603_1608]  (value not drawn)
R75  0R  [RES 0603_1608]  (value not drawn)
R76  0R  [RES 0603_1608]  (value not drawn)
R77  0R  [RES 0603_1608]  (value not drawn)
R78  0R  [RES 0603_1608]  (value not drawn)
R79  0R  [RES 0603_1608]  (value not drawn)
R80  0R  [RES 0603_1608]  (value not drawn)

### Ports
DIG_IO (harness DigCon_DIG_IO), DIG_IO_1_to16 (harness SN74LVCH16T245_B), DIG_IO_17_to_30 (harness SN74LVCH16T245_B)

### Harnesses
SN74LVCH16T245_B: 1B1, 1B2, 1B3, 1B4, 1B5, 1B6, 1B7, 1B8, 2B1, 2B2, 2B3, 2B4, 2B5, 2B6, 2B7, 2B8
DigCon_DIG_IO: DIG_IO_00, DIG_IO_01, DIG_IO_02, DIG_IO_03, DIG_IO_04, DIG_IO_05, DIG_IO_06, DIG_IO_07, DIG_IO_08, DIG_IO_09, DIG_IO_10, DIG_IO_11, DIG_IO_12, DIG_IO_13, DIG_IO_14, DIG_IO_15, DIG_IO_16, DIG_IO_17, DIG_IO_18, DIG_IO_19, DIG_IO_20, DIG_IO_21, DIG_IO_22, DIG_IO_23, DIG_IO_24, DIG_IO_25, DIG_IO_26, DIG_IO_27, DIG_IO_28, DIG_IO_29

### Nets
1B1: R65.2 ; port DIG_IO_1_to16.1B1
1B2: R66.2 ; port DIG_IO_1_to16.1B2
1B3: R67.2 ; port DIG_IO_1_to16.1B3
1B3: R51.2 ; port DIG_IO_17_to_30.1B3  [a separate net that carries the same name]
1B4: R68.2 ; port DIG_IO_1_to16.1B4
1B4: R52.2 ; port DIG_IO_17_to_30.1B4  [a separate net that carries the same name]
1B5: R69.2 ; port DIG_IO_1_to16.1B5
1B5: R53.2 ; port DIG_IO_17_to_30.1B5  [a separate net that carries the same name]
1B6: R70.2 ; port DIG_IO_1_to16.1B6
1B6: R54.2 ; port DIG_IO_17_to_30.1B6  [a separate net that carries the same name]
1B7: R71.2 ; port DIG_IO_1_to16.1B7
1B7: R55.2 ; port DIG_IO_17_to_30.1B7  [a separate net that carries the same name]
1B8: R72.2 ; port DIG_IO_1_to16.1B8
1B8: R56.2 ; port DIG_IO_17_to_30.1B8  [a separate net that carries the same name]
2B1: R73.2 ; port DIG_IO_1_to16.2B1
2B1: R57.2 ; port DIG_IO_17_to_30.2B1  [a separate net that carries the same name]
2B2: R74.2 ; port DIG_IO_1_to16.2B2
2B2: R58.2 ; port DIG_IO_17_to_30.2B2  [a separate net that carries the same name]
2B3: R75.2 ; port DIG_IO_1_to16.2B3
2B3: R59.2 ; port DIG_IO_17_to_30.2B3  [a separate net that carries the same name]
2B4: R76.2 ; port DIG_IO_1_to16.2B4
2B4: R60.2 ; port DIG_IO_17_to_30.2B4  [a separate net that carries the same name]
2B5: R77.2 ; port DIG_IO_1_to16.2B5
2B5: R61.2 ; port DIG_IO_17_to_30.2B5  [a separate net that carries the same name]
2B6: R78.2 ; port DIG_IO_1_to16.2B6
2B6: R62.2 ; port DIG_IO_17_to_30.2B6  [a separate net that carries the same name]
2B7: R79.2 ; port DIG_IO_1_to16.2B7
2B7: R63.2 ; port DIG_IO_17_to_30.2B7  [a separate net that carries the same name]
2B8: R80.2 ; port DIG_IO_1_to16.2B8
2B8: R64.2 ; port DIG_IO_17_to_30.2B8  [a separate net that carries the same name]
DIG_IO_00: R80.1 ; port DIG_IO.DIG_IO_00
DIG_IO_01: R79.1 ; port DIG_IO.DIG_IO_01
DIG_IO_02: R78.1 ; port DIG_IO.DIG_IO_02
DIG_IO_03: R77.1 ; port DIG_IO.DIG_IO_03
DIG_IO_04: R76.1 ; port DIG_IO.DIG_IO_04
DIG_IO_05: R75.1 ; port DIG_IO.DIG_IO_05
DIG_IO_06: R74.1 ; port DIG_IO.DIG_IO_06
DIG_IO_07: R73.1 ; port DIG_IO.DIG_IO_07
DIG_IO_08: R72.1 ; port DIG_IO.DIG_IO_08
DIG_IO_09: R71.1 ; port DIG_IO.DIG_IO_09
DIG_IO_10: R70.1 ; port DIG_IO.DIG_IO_10
DIG_IO_11: R69.1 ; port DIG_IO.DIG_IO_11
DIG_IO_12: R68.1 ; port DIG_IO.DIG_IO_12
DIG_IO_13: R67.1 ; port DIG_IO.DIG_IO_13
DIG_IO_14: R66.1 ; port DIG_IO.DIG_IO_14
DIG_IO_15: R65.1 ; port DIG_IO.DIG_IO_15
DIG_IO_16: R64.1 ; port DIG_IO.DIG_IO_16
DIG_IO_17: R63.1 ; port DIG_IO.DIG_IO_17
DIG_IO_18: R62.1 ; port DIG_IO.DIG_IO_18
DIG_IO_19: R61.1 ; port DIG_IO.DIG_IO_19
DIG_IO_20: R60.1 ; port DIG_IO.DIG_IO_20
DIG_IO_21: R59.1 ; port DIG_IO.DIG_IO_21
DIG_IO_22: R58.1 ; port DIG_IO.DIG_IO_22
DIG_IO_23: R57.1 ; port DIG_IO.DIG_IO_23
DIG_IO_24: R56.1 ; port DIG_IO.DIG_IO_24
DIG_IO_25: R55.1 ; port DIG_IO.DIG_IO_25
DIG_IO_26: R54.1 ; port DIG_IO.DIG_IO_26
DIG_IO_27: R53.1 ; port DIG_IO.DIG_IO_27
DIG_IO_28: R52.1 ; port DIG_IO.DIG_IO_28
DIG_IO_29: R51.1 ; port DIG_IO.DIG_IO_29

### Notes on the sheet
- Jumpers to skip 5V stage
- Title
- Size:
- Date:
- A4
- Revision:
- Time:
- Sheet
- of
- Author:
- Project:

### Library data of the parts
R51-R80 = RC0603JR-070RL: as R1 on sheet TopSheet; Manufacturer Part Number: RC0603JR-070RL; PartID: 1; Created On: 14.12.2020 16:17:14; ComponentLink1Description: Datasheet; ComponentLink1URL: https://www.mouser.de/datasheet/2/447/PYu-RC_Group_51_RoHS_L_10-1664068.pdf; Component Type: SMD resistor; Device Package: 0603; Last Updated: 04.03.2021 09:09:42; Mounting Type: SMD; Supplier 1: Mouser; Supplier Part Number 1: 603-RC0603JR-070RL; Type: Resistor; Value: 0R; Live Cycle Status: 1; Stock number: Labor SMD Container; LCSC Part Number: C21189; Supplier 2: LCSC; Supplier Part Number 2: C21189

## Sheet Snubber5VLS.SchDoc
size A4; Author: T. Wendt; CompanyName: Technische Hochschule Nürnberg Georg Simon Ohm; Address1: Fürther Straße 250; Address2: 90429 Nürnberg; Address3: GERMANY; DocumentNumber: 12; SheetNumber: 12; SheetTotal: 16; CompanyName2: Institut ELSYS
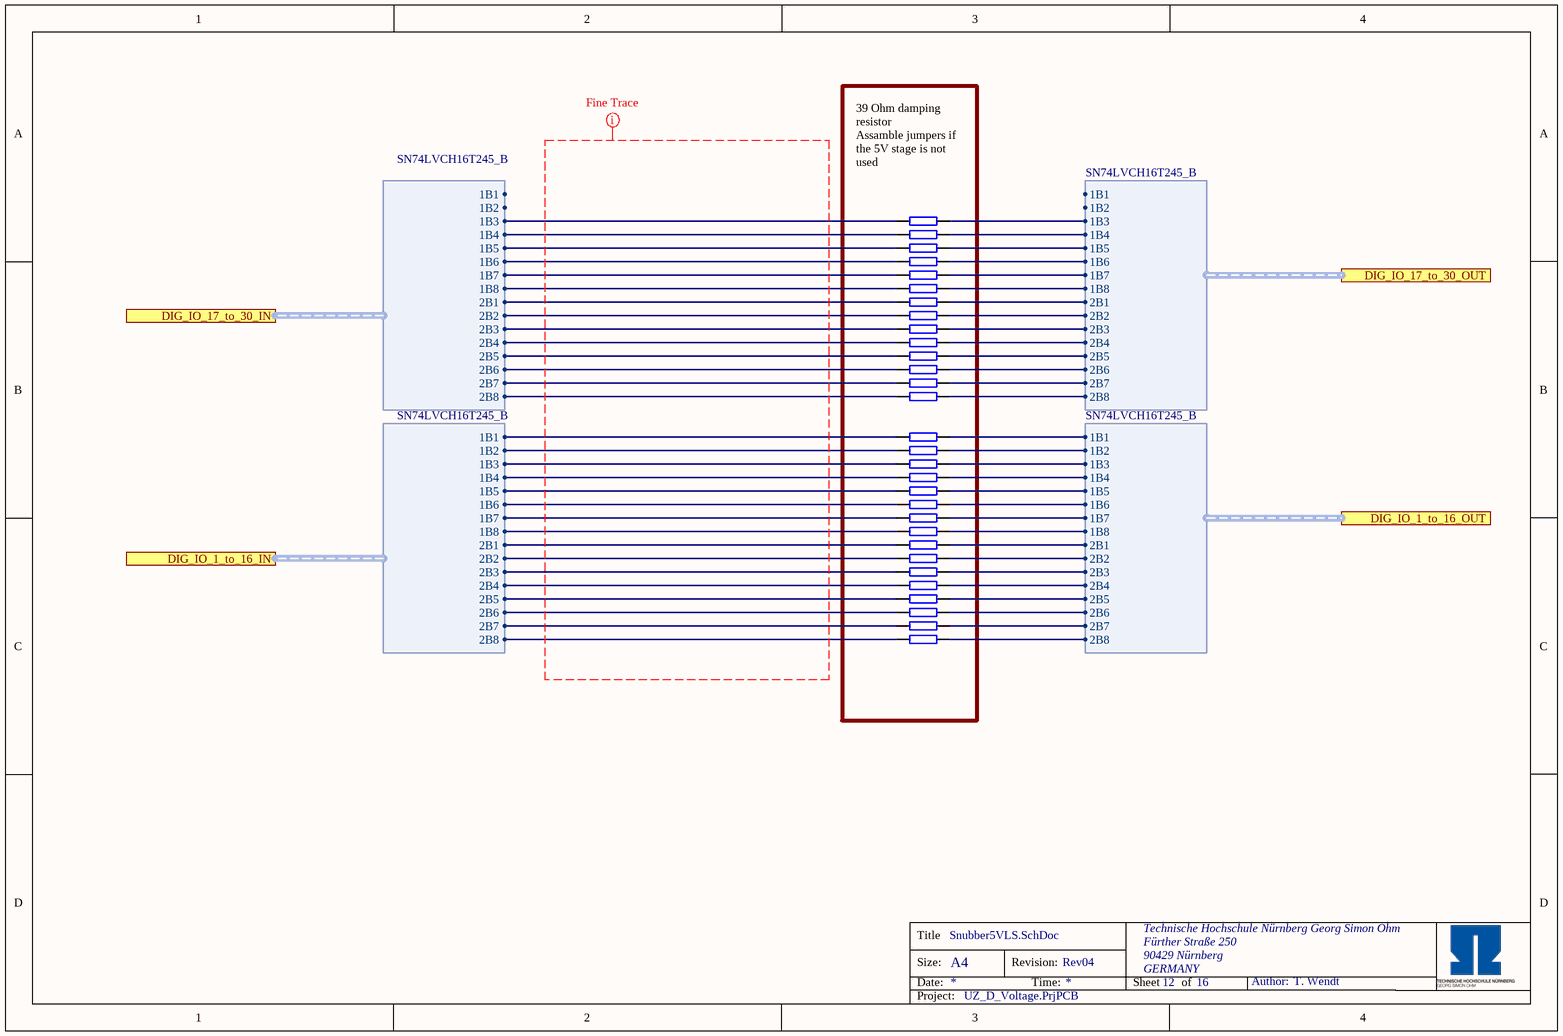
[diagram p5: Snubber5VLS.SchDoc]

### Parts
R144  39R  [RES 0603_1608]  (value not drawn)
R145  39R  [RES 0603_1608]  (value not drawn)
R146  39R  [RES 0603_1608]  (value not drawn)
R147  39R  [RES 0603_1608]  (value not drawn)
R148  39R  [RES 0603_1608]  (value not drawn)
R149  39R  [RES 0603_1608]  (value not drawn)
R150  39R  [RES 0603_1608]  (value not drawn)
R151  39R  [RES 0603_1608]  (value not drawn)
R152  39R  [RES 0603_1608]  (value not drawn)
R153  39R  [RES 0603_1608]  (value not drawn)
R154  39R  [RES 0603_1608]  (value not drawn)
R155  39R  [RES 0603_1608]  (value not drawn)
R156  39R  [RES 0603_1608]  (value not drawn)
R157  39R  [RES 0603_1608]  (value not drawn)
R158  39R  [RES 0603_1608]  (value not drawn)
R159  39R  [RES 0603_1608]  (value not drawn)
R160  39R  [RES 0603_1608]  (value not drawn)
R161  39R  [RES 0603_1608]  (value not drawn)
R162  39R  [RES 0603_1608]  (value not drawn)
R163  39R  [RES 0603_1608]  (value not drawn)
R164  39R  [RES 0603_1608]  (value not drawn)
R165  39R  [RES 0603_1608]  (value not drawn)
R166  39R  [RES 0603_1608]  (value not drawn)
R167  39R  [RES 0603_1608]  (value not drawn)
R168  39R  [RES 0603_1608]  (value not drawn)
R169  39R  [RES 0603_1608]  (value not drawn)
R170  39R  [RES 0603_1608]  (value not drawn)
R171  39R  [RES 0603_1608]  (value not drawn)
R172  39R  [RES 0603_1608]  (value not drawn)
R173  39R  [RES 0603_1608]  (value not drawn)

### Ports
DIG_IO_1_to_16_IN (harness SN74LVCH16T245_B), DIG_IO_1_to_16_OUT (harness SN74LVCH16T245_B), DIG_IO_17_to_30_IN (harness SN74LVCH16T245_B), DIG_IO_17_to_30_OUT (harness SN74LVCH16T245_B)

### Harnesses
SN74LVCH16T245_B: 1B1, 1B2, 1B3, 1B4, 1B5, 1B6, 1B7, 1B8, 2B1, 2B2, 2B3, 2B4, 2B5, 2B6, 2B7, 2B8

### Nets
1B1: R159.1 ; port DIG_IO_1_to_16_IN.1B1
1B2: R158.1 ; port DIG_IO_1_to_16_IN.1B2
1B3: R157.1 ; port DIG_IO_1_to_16_IN.1B3
1B3: R173.1 ; port DIG_IO_17_to_30_IN.1B3  [a separate net that carries the same name]
1B4: R156.1 ; port DIG_IO_1_to_16_IN.1B4
1B4: R172.1 ; port DIG_IO_17_to_30_IN.1B4  [a separate net that carries the same name]
1B5: R155.1 ; port DIG_IO_1_to_16_IN.1B5
1B5: R171.1 ; port DIG_IO_17_to_30_IN.1B5  [a separate net that carries the same name]
1B6: R154.1 ; port DIG_IO_1_to_16_IN.1B6
1B6: R170.1 ; port DIG_IO_17_to_30_IN.1B6  [a separate net that carries the same name]
1B7: R153.1 ; port DIG_IO_1_to_16_IN.1B7
1B7: R169.1 ; port DIG_IO_17_to_30_IN.1B7  [a separate net that carries the same name]
1B8: R152.1 ; port DIG_IO_1_to_16_IN.1B8
1B8: R168.1 ; port DIG_IO_17_to_30_IN.1B8  [a separate net that carries the same name]
2B1: R151.1 ; port DIG_IO_1_to_16_IN.2B1
2B1: R167.1 ; port DIG_IO_17_to_30_IN.2B1  [a separate net that carries the same name]
2B2: R150.1 ; port DIG_IO_1_to_16_IN.2B2
2B2: R166.1 ; port DIG_IO_17_to_30_IN.2B2  [a separate net that carries the same name]
2B3: R149.1 ; port DIG_IO_1_to_16_IN.2B3
2B3: R165.1 ; port DIG_IO_17_to_30_IN.2B3  [a separate net that carries the same name]
2B4: R148.1 ; port DIG_IO_1_to_16_IN.2B4
2B4: R164.1 ; port DIG_IO_17_to_30_IN.2B4  [a separate net that carries the same name]
2B5: R147.1 ; port DIG_IO_1_to_16_IN.2B5
2B5: R163.1 ; port DIG_IO_17_to_30_IN.2B5  [a separate net that carries the same name]
2B6: R146.1 ; port DIG_IO_1_to_16_IN.2B6
2B6: R162.1 ; port DIG_IO_17_to_30_IN.2B6  [a separate net that carries the same name]
2B7: R145.1 ; port DIG_IO_1_to_16_IN.2B7
2B7: R161.1 ; port DIG_IO_17_to_30_IN.2B7  [a separate net that carries the same name]
2B8: R144.1 ; port DIG_IO_1_to_16_IN.2B8
2B8: R160.1 ; port DIG_IO_17_to_30_IN.2B8  [a separate net that carries the same name]
DIG_IO_5V_A1: R144.2 ; port DIG_IO_1_to_16_OUT.2B8
DIG_IO_5V_A2: R150.2 ; port DIG_IO_1_to_16_OUT.2B2
DIG_IO_5V_A3: R156.2 ; port DIG_IO_1_to_16_OUT.1B4
DIG_IO_5V_A4: R162.2 ; port DIG_IO_17_to_30_OUT.2B6
DIG_IO_5V_A5: R168.2 ; port DIG_IO_17_to_30_OUT.1B8
DIG_IO_5V_B1: R145.2 ; port DIG_IO_1_to_16_OUT.2B7
DIG_IO_5V_B2: R151.2 ; port DIG_IO_1_to_16_OUT.2B1
DIG_IO_5V_B3: R157.2 ; port DIG_IO_1_to_16_OUT.1B3
DIG_IO_5V_B4: R163.2 ; port DIG_IO_17_to_30_OUT.2B5
DIG_IO_5V_B5: R169.2 ; port DIG_IO_17_to_30_OUT.1B7
DIG_IO_5V_C1: R146.2 ; port DIG_IO_1_to_16_OUT.2B6
DIG_IO_5V_C2: R152.2 ; port DIG_IO_1_to_16_OUT.1B8
DIG_IO_5V_C3: R158.2 ; port DIG_IO_1_to_16_OUT.1B2
DIG_IO_5V_C4: R164.2 ; port DIG_IO_17_to_30_OUT.2B4
DIG_IO_5V_C5: R170.2 ; port DIG_IO_17_to_30_OUT.1B6
DIG_IO_5V_D1: R147.2 ; port DIG_IO_1_to_16_OUT.2B5
DIG_IO_5V_D2: R153.2 ; port DIG_IO_1_to_16_OUT.1B7
DIG_IO_5V_D3: R159.2 ; port DIG_IO_1_to_16_OUT.1B1
DIG_IO_5V_D4: R165.2 ; port DIG_IO_17_to_30_OUT.2B3
DIG_IO_5V_D5: R171.2 ; port DIG_IO_17_to_30_OUT.1B5
DIG_IO_5V_E1: R148.2 ; port DIG_IO_1_to_16_OUT.2B4
DIG_IO_5V_E2: R154.2 ; port DIG_IO_1_to_16_OUT.1B6
DIG_IO_5V_E3: R160.2 ; port DIG_IO_17_to_30_OUT.2B8
DIG_IO_5V_E4: R166.2 ; port DIG_IO_17_to_30_OUT.2B2
DIG_IO_5V_E5: R172.2 ; port DIG_IO_17_to_30_OUT.1B4
DIG_IO_5V_F1: R149.2 ; port DIG_IO_1_to_16_OUT.2B3
DIG_IO_5V_F2: R155.2 ; port DIG_IO_1_to_16_OUT.1B5
DIG_IO_5V_F3: R161.2 ; port DIG_IO_17_to_30_OUT.2B7
DIG_IO_5V_F4: R167.2 ; port DIG_IO_17_to_30_OUT.2B1
DIG_IO_5V_F5: R173.2 ; port DIG_IO_17_to_30_OUT.1B3

### Layout directives
net class Fine Trace: (no net found under the mark)

### Notes on the sheet
- 39 Ohm damping resistor
  Assamble jumpers if the 5V stage is not used
- Title
- Size:
- Date:
- A4
- Revision:
- Time:
- Sheet
- of
- Author:
- Project:

### Library data of the parts
R144-R173 = RK73B1JTTDD390J: SMD resistor E24 series; Manufacturer: KOA Speer; Tolerance: 5%; Created from: MGremer; Manufacturer Part Number: RK73B1JTTDD390J; PartID: 40; Created On: 14.12.2020 16:17:14; ComponentLink1Description: Datasheet; ComponentLink1URL: https://www.mouser.de/datasheet/2/219/RK73B-1825463.pdf; Component Type: SMD resistor; Device Package: 0603; Last Updated: 04.03.2021 09:09:42; Mounting Type: SMD; Supplier 1: Mouser; Supplier Part Number 1: 660-RK73B1JTTDD390J; Type: Resistor; Value: 39R; Live Cycle Status: 1; Stock number: Labor SMD Container; LCSC Part Number: C23154; Supplier 2: LCSC; Supplier Part Number 2: C23154

## Sheet 5V_to_15V.SchDoc
size A4; Author: T. Wendt; CompanyName: Technische Hochschule Nürnberg Georg Simon Ohm; Address1: Fürther Straße 250; Address2: 90429 Nürnberg; Address3: GERMANY; DocumentNumber: 4; SheetNumber: 4; SheetTotal: 16; CompanyName2: Institut ELSYS
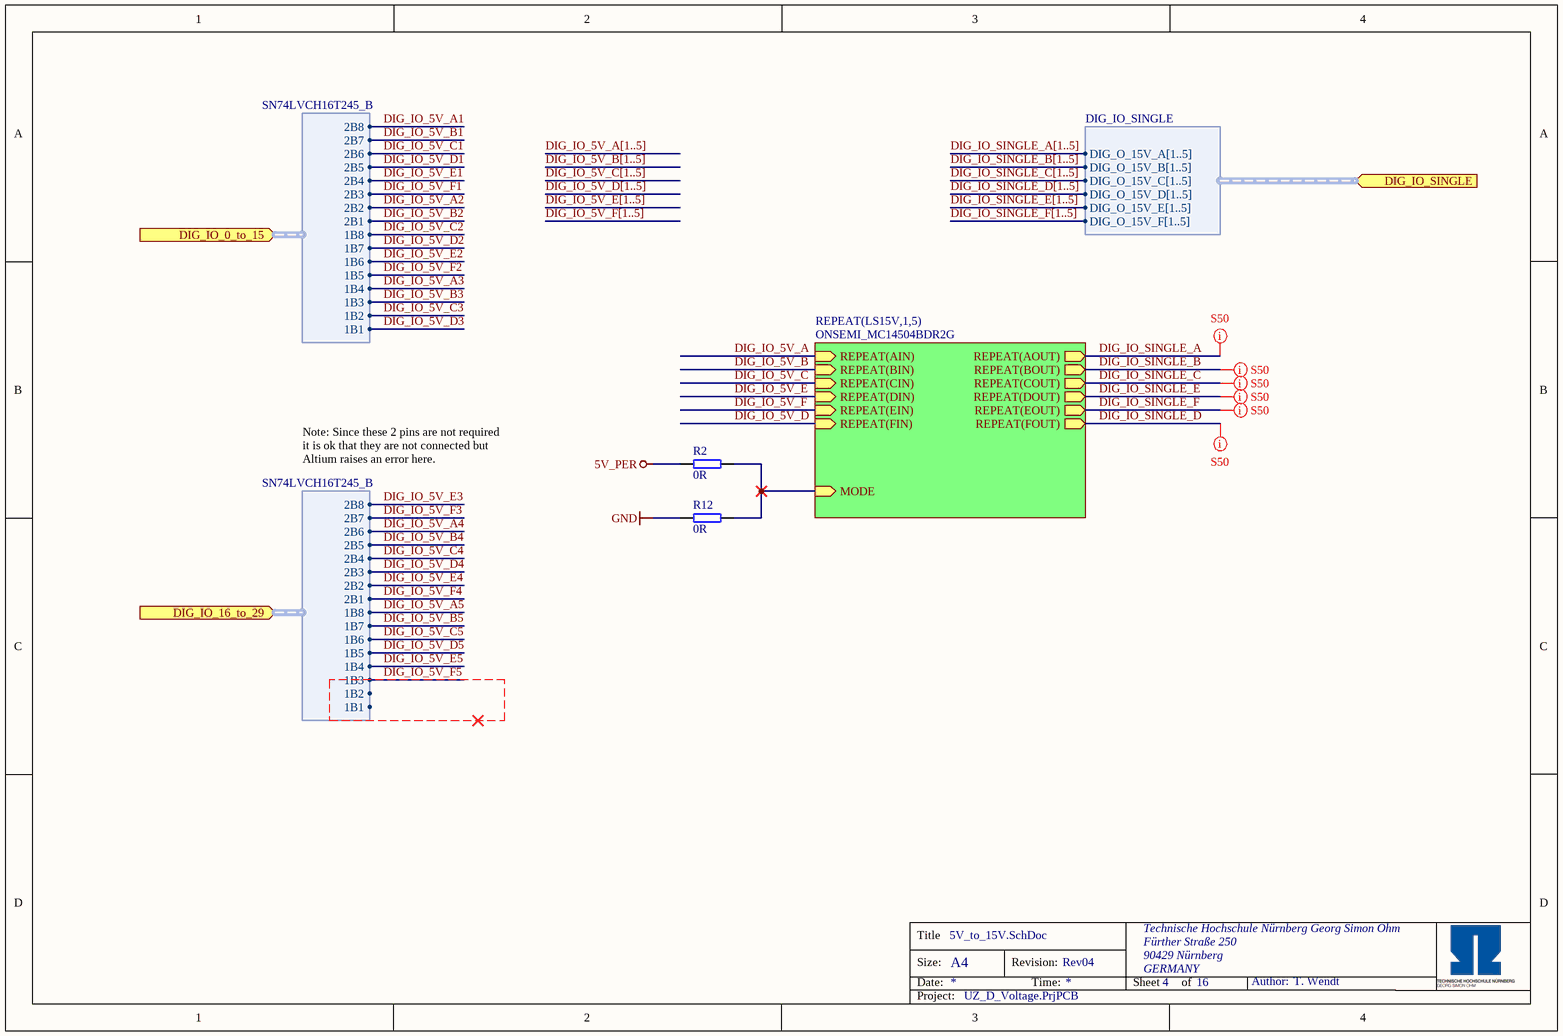
[diagram p6: 5V_to_15V.SchDoc]

### Parts
R2  0R  [RES 0603_1608]
R12  0R  [RES 0603_1608]

### Sub-sheets
REPEAT(LS15V,1,5) = ONSEMI_MC14504BDR2G: REPEAT(FOUT) (out), REPEAT(EOUT) (out), REPEAT(DIN) (in), MODE (in), REPEAT(CIN) (in), REPEAT(BOUT) (out), REPEAT(FIN) (in), REPEAT(EIN) (in), REPEAT(BIN) (in), REPEAT(COUT) (out), REPEAT(AIN) (in), REPEAT(AOUT) (out), REPEAT(DOUT) (out)

### Ports
DIG_IO_0_to_15 (in, harness SN74LVCH16T245_B), DIG_IO_16_to_29 (in, harness SN74LVCH16T245_B), DIG_IO_SINGLE (in, harness DIG_IO_SINGLE)

### Harnesses
SN74LVCH16T245_B: 1B1, 1B2, 1B3, 1B4, 1B5, 1B6, 1B7, 1B8, 2B1, 2B2, 2B3, 2B4, 2B5, 2B6, 2B7, 2B8
DIG_IO_SINGLE: DIG_O_15V_A[1..5], DIG_O_15V_B[1..5], DIG_O_15V_C[1..5], DIG_O_15V_D[1..5], DIG_O_15V_E[1..5], DIG_O_15V_F[1..5]

### Nets
5V_PER: R2.1
GND: R12.1
DIG_IO_5V_A: sheet REPEAT(LS15V,1,5)/REPEAT(AIN)
DIG_IO_5V_B: sheet REPEAT(LS15V,1,5)/REPEAT(BIN)
DIG_IO_5V_C: sheet REPEAT(LS15V,1,5)/REPEAT(CIN)
DIG_IO_5V_D: sheet REPEAT(LS15V,1,5)/REPEAT(FIN)
DIG_IO_5V_E: sheet REPEAT(LS15V,1,5)/REPEAT(DIN)
DIG_IO_5V_F: sheet REPEAT(LS15V,1,5)/REPEAT(EIN)
DIG_IO_SINGLE_A: sheet REPEAT(LS15V,1,5)/REPEAT(AOUT)
DIG_IO_SINGLE_B: sheet REPEAT(LS15V,1,5)/REPEAT(BOUT)
DIG_IO_SINGLE_C: sheet REPEAT(LS15V,1,5)/REPEAT(COUT)
DIG_IO_SINGLE_D: sheet REPEAT(LS15V,1,5)/REPEAT(FOUT)
DIG_IO_SINGLE_E: sheet REPEAT(LS15V,1,5)/REPEAT(DOUT)
DIG_IO_SINGLE_F: sheet REPEAT(LS15V,1,5)/REPEAT(EOUT)
NetR2_2: R2.2 R12.2 ; sheet REPEAT(LS15V,1,5)/MODE

### Buses and harness runs
bus DIG_IO_5V_A[1..5]
bus DIG_IO_5V_B[1..5]
bus DIG_IO_5V_C[1..5]
bus DIG_IO_5V_D[1..5]
bus DIG_IO_5V_E[1..5]
bus DIG_IO_5V_F[1..5]
bus DIG_IO_SINGLE_A[1..5]
bus DIG_IO_SINGLE_B[1..5]
bus DIG_IO_SINGLE_C[1..5]
bus DIG_IO_SINGLE_D[1..5]
bus DIG_IO_SINGLE_E[1..5]
bus DIG_IO_SINGLE_F[1..5]

### Layout directives
net class S50: DIG_IO_SINGLE_A, DIG_IO_SINGLE_B, DIG_IO_SINGLE_C, DIG_IO_SINGLE_D, DIG_IO_SINGLE_E, DIG_IO_SINGLE_F

### Notes on the sheet
- Note: Since these 2 pins are not required it is ok that they are not connected but Altium raises an error here.
- Title
- Size:
- Date:
- A4
- Revision:
- Time:
- Sheet
- of
- Author:
- Project:

### Library data of the parts
R2 R12 = RC0603JR-070RL: as R1 on sheet TopSheet; Manufacturer Part Number: RC0603JR-070RL; PartID: 1; Created On: 14.12.2020 16:17:14; ComponentLink1Description: Datasheet; ComponentLink1URL: https://www.mouser.de/datasheet/2/447/PYu-RC_Group_51_RoHS_L_10-1664068.pdf; Component Type: SMD resistor; Device Package: 0603; Last Updated: 04.03.2021 09:09:42; Mounting Type: SMD; Supplier 1: Mouser; Supplier Part Number 1: 603-RC0603JR-070RL; Type: Resistor; Value: 0R; Live Cycle Status: 1; Stock number: Labor SMD Container; LCSC Part Number: C21189; Supplier 2: LCSC; Supplier Part Number 2: C21189

## Sheet ONSEMI_MC14504BDR2G.SchDoc
size A4; Author: T. Wendt; CompanyName: Technische Hochschule Nürnberg Georg Simon Ohm; Address1: Fürther Straße 250; Address2: 90429 Nürnberg; Address3: GERMANY; DocumentNumber: 6; SheetNumber: 6; SheetTotal: 16; CompanyName2: Institut ELSYS
Used 5 times, as channels SigCon_top/LS15V_top/LS15V1, SigCon_top/LS15V_top/LS15V2, SigCon_top/LS15V_top/LS15V3, SigCon_top/LS15V_top/LS15V4, SigCon_top/LS15V_top/LS15V5. Parts and nets are listed once, with the designators drawn on the sheet.
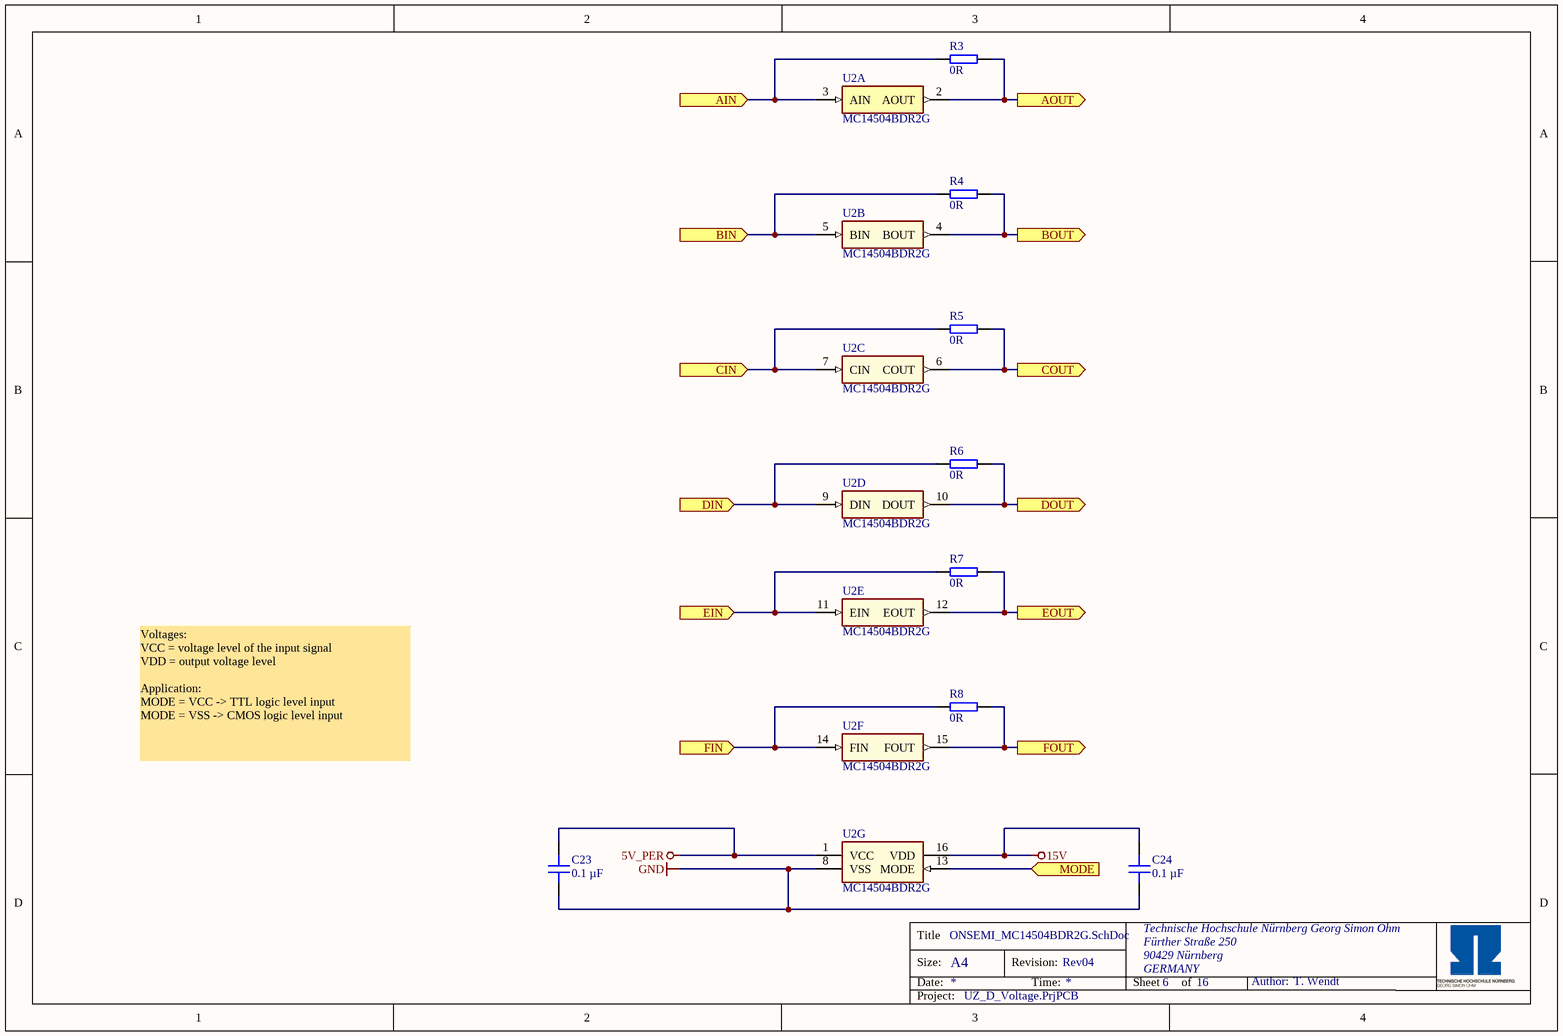
[diagram p7: ONSEMI_MC14504BDR2G.SchDoc]

### Parts
C23  0.1 µF  [C_0603]
C24  0.1 µF  [C_0603]
R3  0R  [RES 0603_1608 NO TO]
R4  0R  [RES 0603_1608 NO TO]
R5  0R  [RES 0603_1608 NO TO]
R6  0R  [RES 0603_1608 NO TO]
R7  0R  [RES 0603_1608 NO TO]
R8  0R  [RES 0603_1608 NO TO]
U2  MC14504BDR2G  [SOIC127P600X175-16N]  (parts A,B,C,D,E,F,G of 7)

### Ports
AIN (in), AOUT (out), BIN (in), BOUT (out), CIN (in), COUT (out), DIN (in), DOUT (out), EIN (in), EOUT (out), FIN (in), FOUT (out), MODE (in)

### Nets
5V_PER: C23.2 U2.1(VCC)
15V: C24.2 U2.16(VDD)
GND: C23.1 C24.1 U2.8(VSS)
AIN: R3.1 U2.3(AIN) ; port AIN
AOUT: R3.2 U2.2(AOUT) ; port AOUT
BIN: R4.1 U2.5(BIN) ; port BIN
BOUT: R4.2 U2.4(BOUT) ; port BOUT
CIN: R5.1 U2.7(CIN) ; port CIN
COUT: R5.2 U2.6(COUT) ; port COUT
DIN: R6.1 U2.9(DIN) ; port DIN
DOUT: R6.2 U2.10(DOUT) ; port DOUT
EIN: R7.1 U2.11(EIN) ; port EIN
EOUT: R7.2 U2.12(EOUT) ; port EOUT
FIN: R8.1 U2.14(FIN) ; port FIN
FOUT: R8.2 U2.15(FOUT) ; port FOUT
MODE: U2.13(MODE) ; port MODE

### Channels
SigCon_top/LS15V_top/LS15V1: designators end in A; ports AIN=DIG_IO_5V_A1 AOUT=DIG_IO_SINGLE_A1 BIN=DIG_IO_5V_B1 BOUT=DIG_IO_SINGLE_B1 CIN=DIG_IO_5V_C1 COUT=DIG_IO_SINGLE_C1 DIN=DIG_IO_5V_E1 DOUT=DIG_IO_SINGLE_E1 EIN=DIG_IO_5V_F1 EOUT=DIG_IO_SINGLE_F1 FIN=DIG_IO_5V_D1 FOUT=DIG_IO_SINGLE_D1 MODE=NetR2_2
SigCon_top/LS15V_top/LS15V2: designators end in B; ports AIN=DIG_IO_5V_A2 AOUT=DIG_IO_SINGLE_A2 BIN=DIG_IO_5V_B2 BOUT=DIG_IO_SINGLE_B2 CIN=DIG_IO_5V_C2 COUT=DIG_IO_SINGLE_C2 DIN=DIG_IO_5V_E2 DOUT=DIG_IO_SINGLE_E2 EIN=DIG_IO_5V_F2 EOUT=DIG_IO_SINGLE_F2 FIN=DIG_IO_5V_D2 FOUT=DIG_IO_SINGLE_D2 MODE=NetR2_2
SigCon_top/LS15V_top/LS15V3: designators end in C; ports AIN=DIG_IO_5V_A3 AOUT=DIG_IO_SINGLE_A3 BIN=DIG_IO_5V_B3 BOUT=DIG_IO_SINGLE_B3 CIN=DIG_IO_5V_C3 COUT=DIG_IO_SINGLE_C3 DIN=DIG_IO_5V_E3 DOUT=DIG_IO_SINGLE_E3 EIN=DIG_IO_5V_F3 EOUT=DIG_IO_SINGLE_F3 FIN=DIG_IO_5V_D3 FOUT=DIG_IO_SINGLE_D3 MODE=NetR2_2
SigCon_top/LS15V_top/LS15V4: designators end in D; ports AIN=DIG_IO_5V_A4 AOUT=DIG_IO_SINGLE_A4 BIN=DIG_IO_5V_B4 BOUT=DIG_IO_SINGLE_B4 CIN=DIG_IO_5V_C4 COUT=DIG_IO_SINGLE_C4 DIN=DIG_IO_5V_E4 DOUT=DIG_IO_SINGLE_E4 EIN=DIG_IO_5V_F4 EOUT=DIG_IO_SINGLE_F4 FIN=DIG_IO_5V_D4 FOUT=DIG_IO_SINGLE_D4 MODE=NetR2_2
SigCon_top/LS15V_top/LS15V5: designators end in E; ports AIN=DIG_IO_5V_A5 AOUT=DIG_IO_SINGLE_A5 BIN=DIG_IO_5V_B5 BOUT=DIG_IO_SINGLE_B5 CIN=DIG_IO_5V_C5 COUT=DIG_IO_SINGLE_C5 DIN=DIG_IO_5V_E5 DOUT=DIG_IO_SINGLE_E5 EIN=DIG_IO_5V_F5 EOUT=DIG_IO_SINGLE_F5 FIN=DIG_IO_5V_D5 FOUT=DIG_IO_SINGLE_D5 MODE=NetR2_2

### Notes on the sheet
- Voltages:
  VCC = voltage level of the input signal
  VDD = output voltage level
  Application:
  MODE = VCC -> TTL logic level input
  MODE = VSS -> CMOS logic level input
- Title
- Size:
- Date:
- A4
- Revision:
- Time:
- Sheet
- of
- Author:
- Project:

### Library data of the parts
C23 C24 = C0603X104K5RAC7411: as C1 on sheet TI_SN74LVCH16T245; Manufacturer Part Number: C0603X104K5RAC7411; PartID: 3; Created On: 20.12.2020 13:54:13; ComponentLink1Description: Datasheet; ComponentLink1URL: https://www.mouser.de/datasheet/2/212/1/KEM_C1013_X7R_FT_CAP_SMD-1103280.pdf; Component Type: Capacitor 0603; Device Package: 0603; Last Updated: 04.03.2021 09:24:28; Mounting Type: SMD; Operating Temperature: -55 - 125°C; Series: SMD Comm X7R Flex; Supplier 1: Mouser; Supplier Part Number 1: 80-C0603X104K5R7411; Type: Capacitor; Value: 0.1 µF; Live Cycle Status: 1; Stock number: Labor SMD Container; LCSC Part Number: C14663; Supplier 2: LCSC; Supplier Part Number 2: C14663
R3-R8 = RC0603JR-070RL: as R1 on sheet TopSheet; Manufacturer Part Number: RC0603JR-070RL; PartID: 1; Created On: 14.12.2020 16:17:14; ComponentLink1Description: Datasheet; ComponentLink1URL: https://www.mouser.de/datasheet/2/447/PYu-RC_Group_51_RoHS_L_10-1664068.pdf; Component Type: SMD resistor; Device Package: 0603; Last Updated: 04.03.2021 09:09:42; Mounting Type: SMD; Supplier 1: Mouser; Supplier Part Number 1: 603-RC0603JR-070RL; Supplier 2: LCSC; Supplier Part Number 2: C21189; Type: Resistor; Value: 0R; Live Cycle Status: 1; Stock number: Labor SMD Container; LCSC Part Number: C21189
U2 = MC14504BDR2G: Hex Level Shifter for TTL to CMOS or CMOS to CMOS; Manufacturer: ON Semiconductor; Value: 3 - 18 V; Created from: MGremer; Manufacturer Part Number: MC14504BDR2G; PartID: 1; Created On: 18.01.2021 17:03:44; ComponentLink1Description: Datasheet; ComponentLink1URL: https://www.mouser.de/datasheet/2/308/MC14504B-D-1811151.pdf; Component Type: Level Shifter; Device Package: SOIC-16; Last Updated: 04.03.2021 09:27:14; Mounting Type: SMD; Operating Temperature: -55 - 125 °C; Series: MC14504B; Supplier 1: Mouser; Supplier Part Number 1: 863-MC14504BDR2G; Type: Level Shifter; Live Cycle Status: 1; Stock number: not stored; LCSC Part Number: C7291

## Sheet SingleToDifferential.SchDoc
size A4; Author: T. Wendt; CompanyName: Technische Hochschule Nürnberg Georg Simon Ohm; Address1: Fürther Straße 250; Address2: 90429 Nürnberg; Address3: GERMANY; DocumentNumber: 5; SheetNumber: 5; SheetTotal: 16; CompanyName2: Institut ELSYS
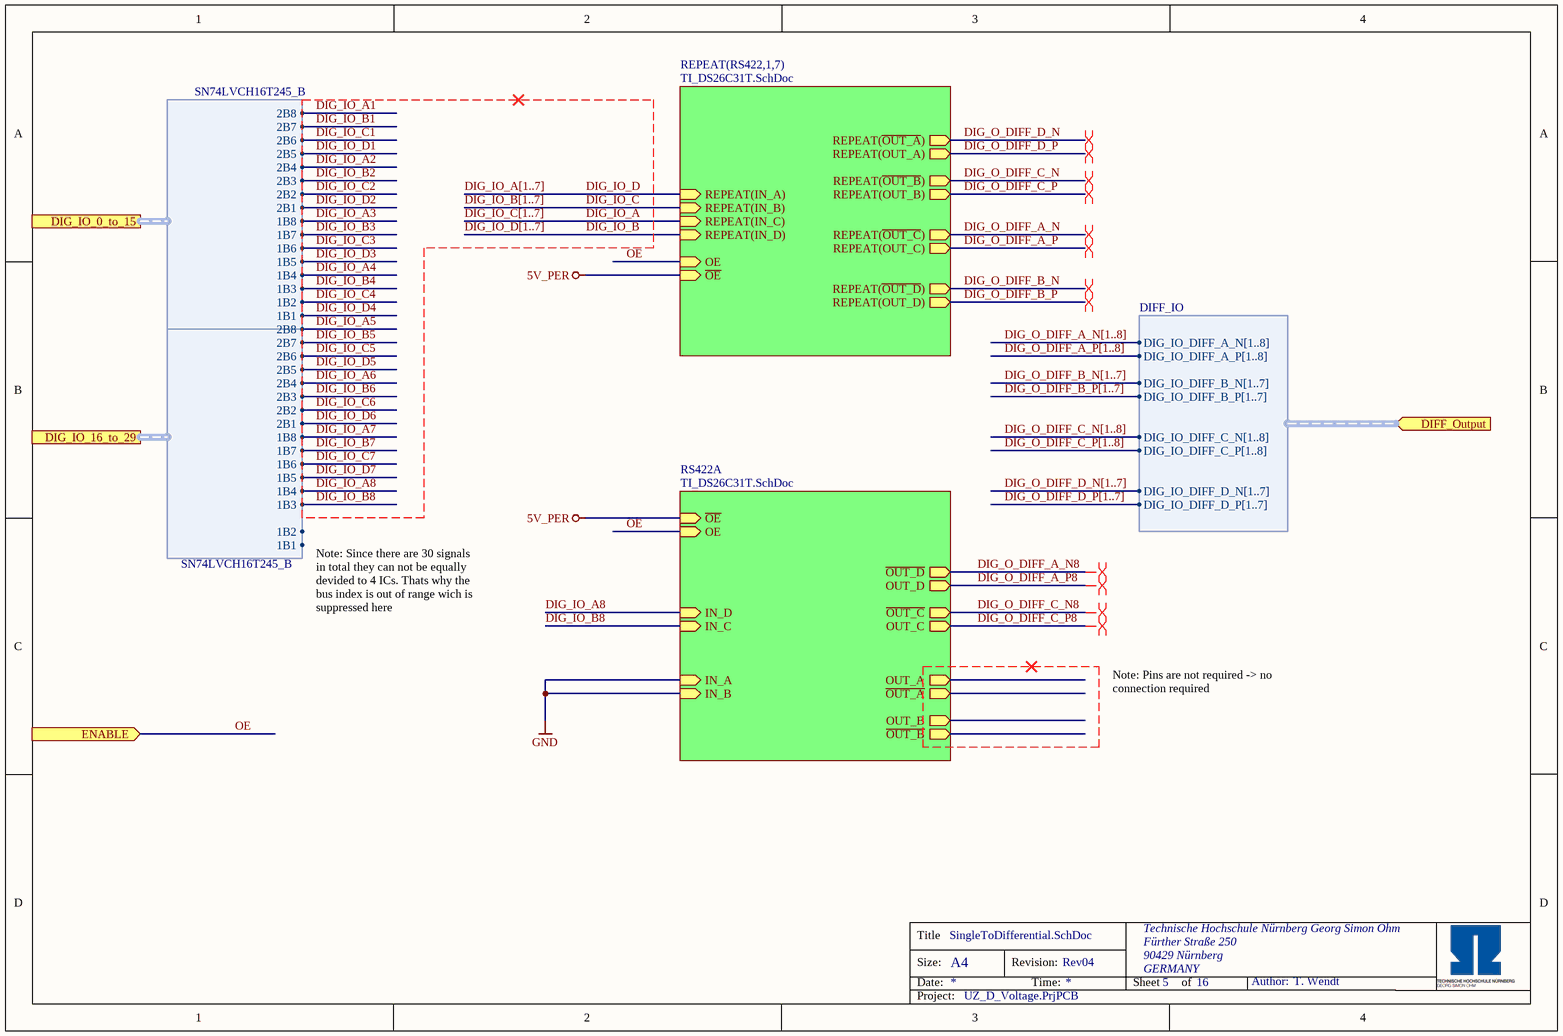
[diagram p8: SingleToDifferential.SchDoc]

### Sub-sheets
REPEAT(RS422,1,7) = TI_DS26C31T.SchDoc: REPEAT(IN_A) (in), REPEAT(IN_B) (in), REPEAT(IN_C) (in), REPEAT(IN_D) (in), REPEAT(~{OUT_A}) (out), REPEAT(OUT_A) (out), REPEAT(OUT_B) (out), REPEAT(~{OUT_B}) (out), REPEAT(~{OUT_C}) (out), REPEAT(OUT_C) (out), REPEAT(~{OUT_D}) (out), REPEAT(OUT_D) (out), OE (in), ~{OE} (in)
RS422A = TI_DS26C31T.SchDoc: IN_D (in), IN_C (in), OUT_D (out), ~{OUT_D} (out), ~{OUT_C} (out), OUT_C (out), ~{OE} (in), OE (in), IN_A (in), IN_B (in), OUT_A (out), ~{OUT_A} (out), OUT_B (out), ~{OUT_B} (out)

### Ports
DIFF_Output (in, harness DIFF_IO), DIG_IO_0_to_15 (harness SN74LVCH16T245_B), DIG_IO_16_to_29 (harness SN74LVCH16T245_B), ENABLE (in)

### Harnesses
DIFF_IO: DIG_IO_DIFF_A_N[1..8], DIG_IO_DIFF_A_P[1..8], DIG_IO_DIFF_B_N[1..7], DIG_IO_DIFF_B_P[1..7], DIG_IO_DIFF_C_P[1..8], DIG_IO_DIFF_C_N[1..8], DIG_IO_DIFF_D_P[1..7], DIG_IO_DIFF_D_N[1..7]
SN74LVCH16T245_B: 1B1, 1B2, 1B3, 1B4, 1B5, 1B6, 1B7, 1B8, 2B1, 2B2, 2B3, 2B4, 2B5, 2B6, 2B7, 2B8

### Nets
5V_PER: sheet RS422A/~{OE}, sheet REPEAT(RS422,1,7)/~{OE}
GND: sheet RS422A/IN_A, sheet RS422A/IN_B
DIG_IO_A: sheet REPEAT(RS422,1,7)/REPEAT(IN_C)
DIG_IO_A8: sheet RS422A/IN_D, port DIG_IO_16_to_29.1B4  [project net DIG_IO_5V_E5]
DIG_IO_B: sheet REPEAT(RS422,1,7)/REPEAT(IN_D)
DIG_IO_B8: sheet RS422A/IN_C, port DIG_IO_16_to_29.1B3  [project net DIG_IO_5V_F5]
DIG_IO_C: sheet REPEAT(RS422,1,7)/REPEAT(IN_B)
DIG_IO_D: sheet REPEAT(RS422,1,7)/REPEAT(IN_A)
DIG_O_DIFF_A_N: sheet REPEAT(RS422,1,7)/REPEAT(~{OUT_C})
DIG_O_DIFF_A_P: sheet REPEAT(RS422,1,7)/REPEAT(OUT_C)
DIG_O_DIFF_B_N: sheet REPEAT(RS422,1,7)/REPEAT(~{OUT_D})
DIG_O_DIFF_B_P: sheet REPEAT(RS422,1,7)/REPEAT(OUT_D)
DIG_O_DIFF_C_N: sheet REPEAT(RS422,1,7)/REPEAT(~{OUT_B})
DIG_O_DIFF_C_P: sheet REPEAT(RS422,1,7)/REPEAT(OUT_B)
DIG_O_DIFF_D_N: sheet REPEAT(RS422,1,7)/REPEAT(~{OUT_A})
DIG_O_DIFF_D_P: sheet REPEAT(RS422,1,7)/REPEAT(OUT_A)
OE: port ENABLE, sheet RS422A/OE, sheet REPEAT(RS422,1,7)/OE  [project net ENABLE]

### Buses and harness runs
bus DIG_IO_A[1..7]
bus DIG_IO_B[1..7]
bus DIG_IO_C[1..7]
bus DIG_IO_D[1..7]
bus DIG_O_DIFF_A_N[1..8]
bus DIG_O_DIFF_A_P[1..8]
bus DIG_O_DIFF_B_N[1..7]
bus DIG_O_DIFF_B_P[1..7]
bus DIG_O_DIFF_C_N[1..8]
bus DIG_O_DIFF_C_P[1..8]
bus DIG_O_DIFF_D_N[1..7]
bus DIG_O_DIFF_D_P[1..7]

### Layout directives
differential pair: DIG_I_DIFF_A_N8, DIG_I_DIFF_A_P8, DIG_I_DIFF_C_N8, DIG_I_DIFF_C_P8, DIG_O_DIFF_A_N, DIG_O_DIFF_A_P, DIG_O_DIFF_B_N, DIG_O_DIFF_B_P, DIG_O_DIFF_C_N, DIG_O_DIFF_C_P, DIG_O_DIFF_D_N, DIG_O_DIFF_D_P

### Notes on the sheet
- Note: Since there are 30 signals in total they can not be equally devided to 4 ICs. Thats why the bus index is out of range wich is suppressed here
- Note: Pins are not required -> no connection required
- Title
- Size:
- Date:
- A4
- Revision:
- Time:
- Sheet
- of
- Author:
- Project: